# Altium project compbrd.PrjPcb
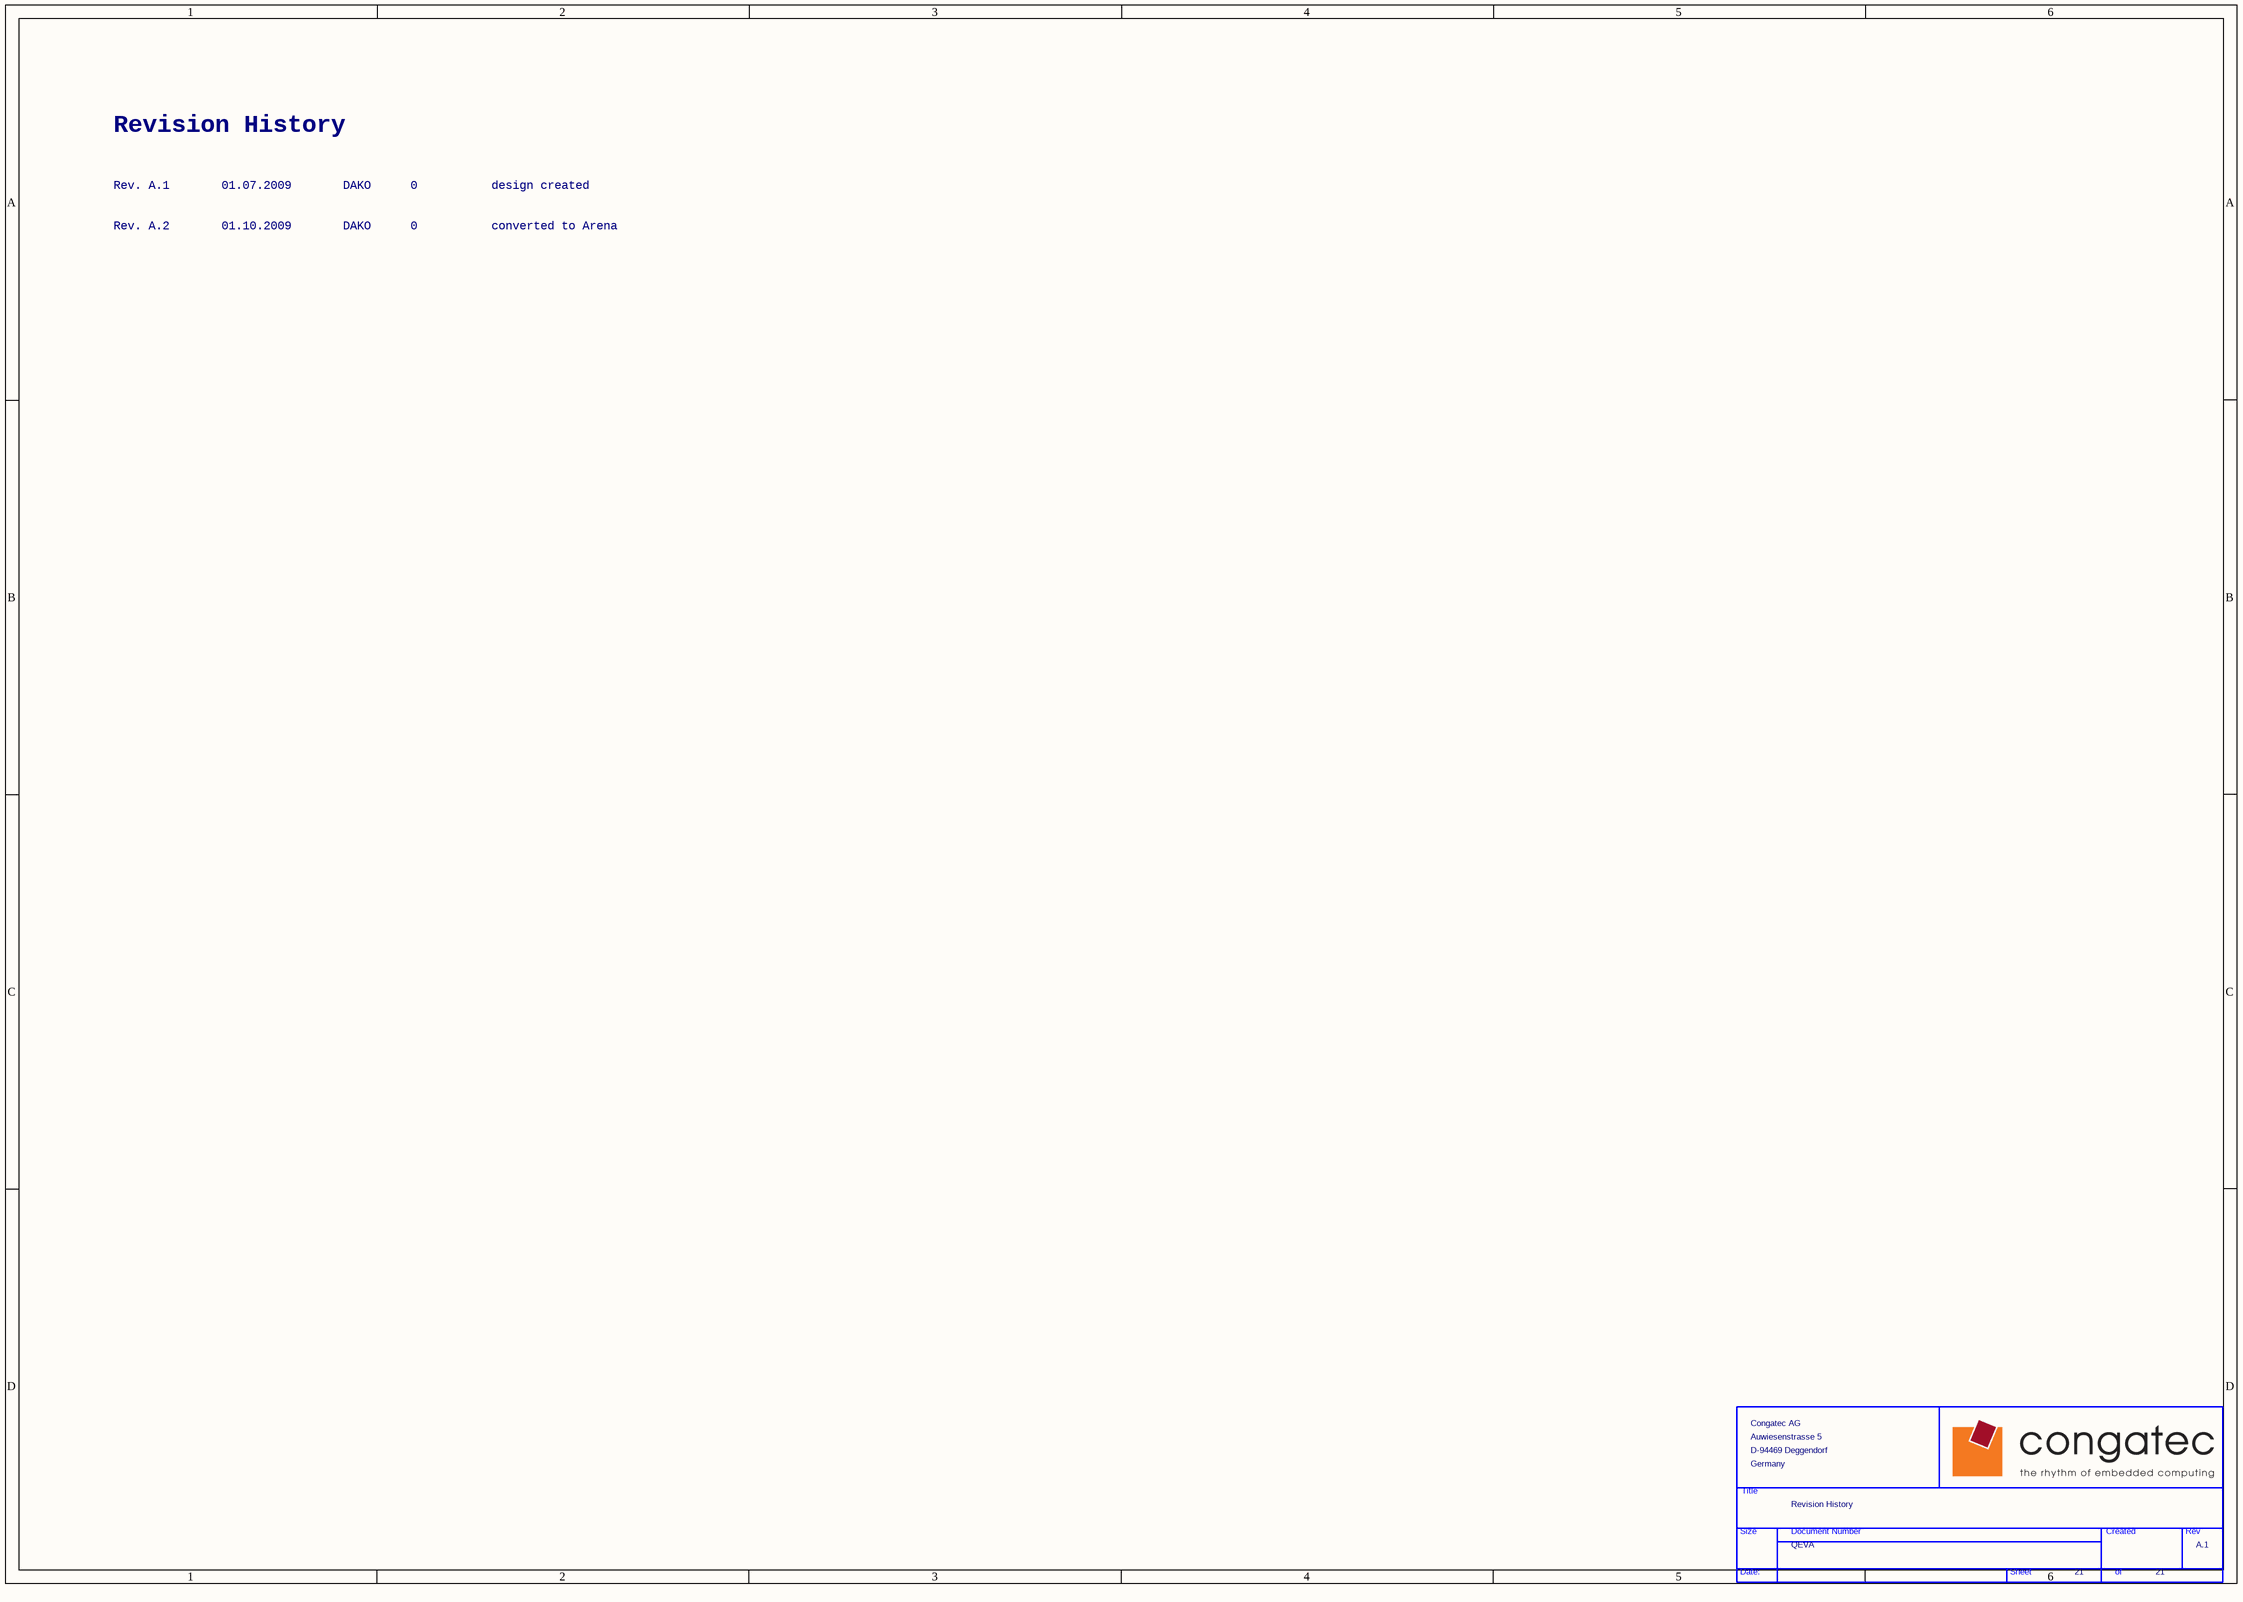
[diagram p0: PG21_ Revision History.SchDoc]
9 sheets, 102 parts. Net scope: global (net labels, ports and power ports of the same name join across sheets).
Sheets:
  PG21_ Revision History.SchDoc
  PG18_ BATT_ SPK _ Featu.SchDoc
  PG17_ LPC FWH _ I2C _ P.SchDoc
  PG14_ Ethernet.SchDoc
  PG13_ USB Ports.SchDoc
  PG12_ SATA _ SDIO.SchDoc
  PG03_ Qseven Connector.SchDoc
  PG02_ Block Diagram.SchDoc
  PG01_ Cover Sheet.SchDoc

## Sheet PG21_ Revision History.SchDoc
size 420 x 297 mm

### Parts
(Parts that share a designator on the sheet are numbered #1, #2 ... from top to bottom, then left to right.)
*#1  Page Count: 21  Title: Revision History  RevCode: A.1  Doc: QEVA  OrgName: Congatec AG  OrgAddr1: Auwiesenstrasse 5  OrgAddr2: D-94469 Deggendorf  OrgAddr3: Germany  (hidden comment: TitleBlock_CONGA)  (graphical)

### Notes on the sheet
- Revision History
- Rev. A.1
- 01.07.2009
- DAKO
- 0
- design created
- Rev. A.2
- 01.10.2009
- converted to Arena
- (in symbol TitleBlock_CONGA) Title; Size; Document Number; Created; Rev; Date:; Sheet; of

### Library data of the parts
*#1 = TitleBlock_CONGA: Page Number: 21; Page Create Date: March  8, 1995

## Sheet PG18_ BATT_ SPK _ Featu.SchDoc
size 420 x 297 mm
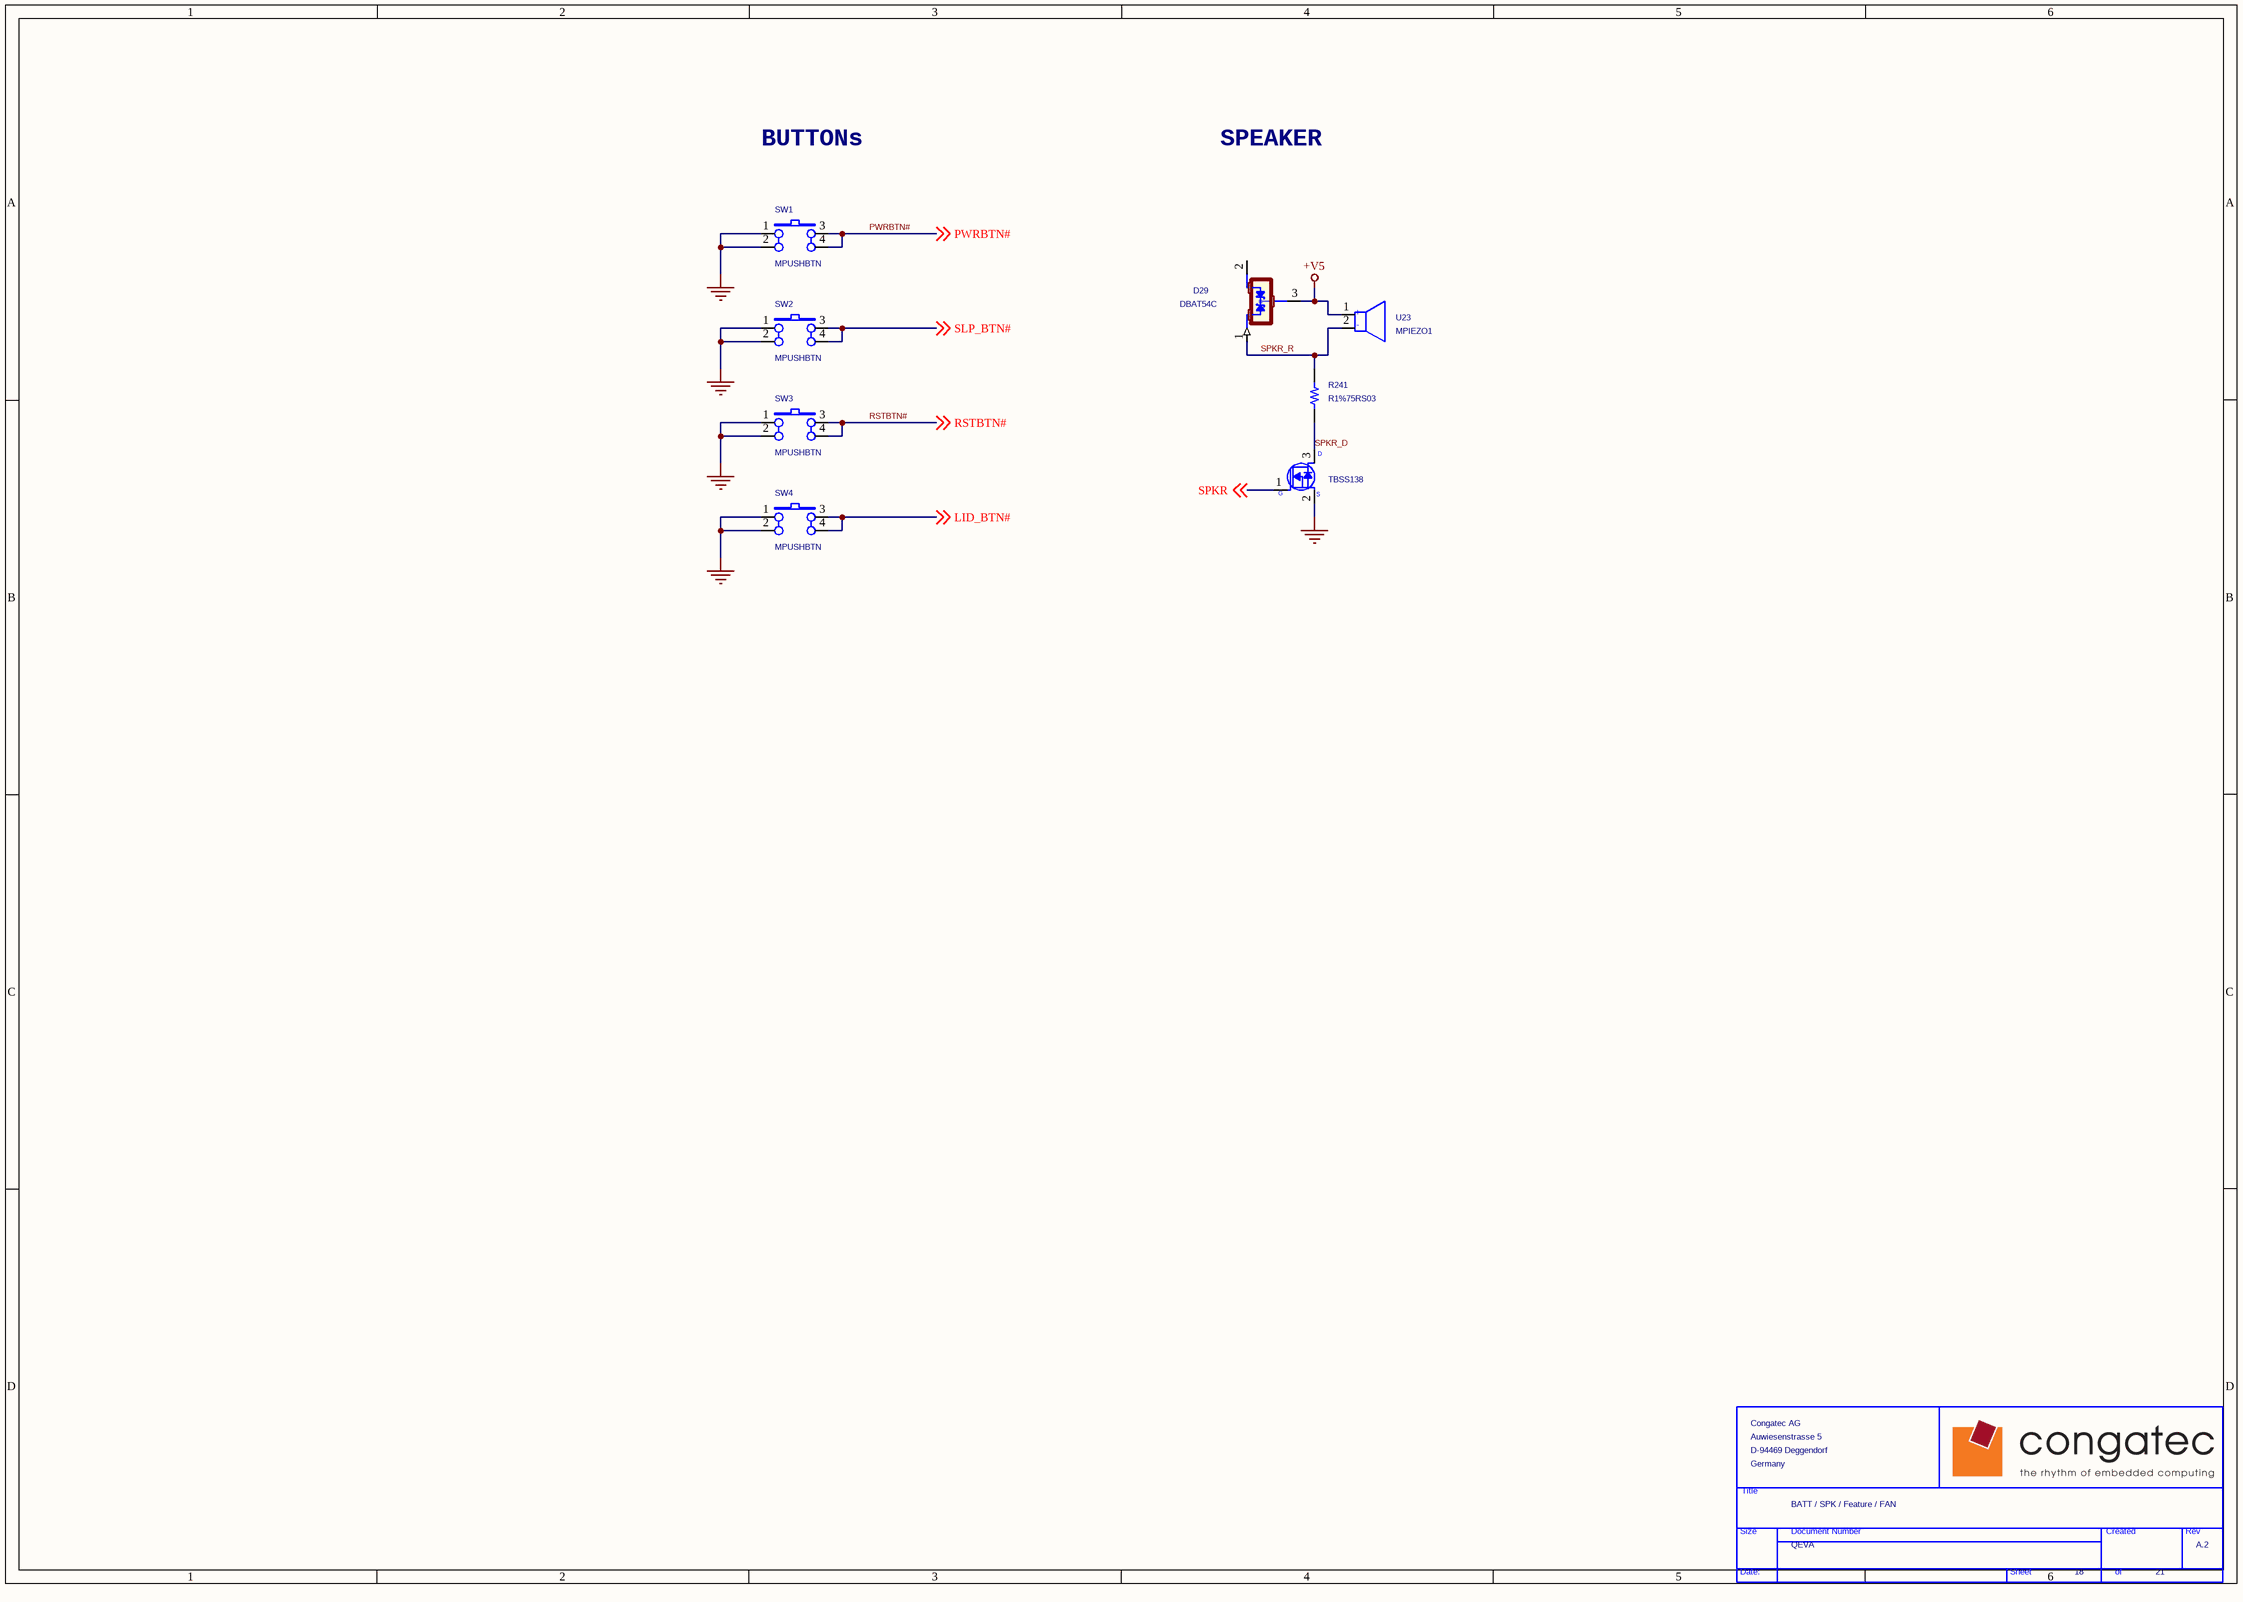
[diagram p1: PG18_ BATT_ SPK _ Featu.SchDoc]

### Parts
(Parts that share a designator on the sheet are numbered #1, #2 ... from top to bottom, then left to right.)
*#2  Page Count: 21  Page Number: 18  Title: BATT / SPK / Feature / FAN  RevCode: A.2  Doc: QEVA  OrgName: Congatec AG  OrgAddr1: Auwiesenstrasse 5  OrgAddr2: D-94469 Deggendorf  OrgAddr3: Germany  (hidden comment: TitleBlock_CONGA)  (graphical)
D29  DBAT54C  [SOT-23A]
Q19  TBSS138  [SOT-23A]
R241  R1%75RS03  [R0603]
SW1  MPUSHBTN  [SW_4P_193x193_H59]
SW2  MPUSHBTN  [SW_4P_193x193_H59]
SW3  MPUSHBTN  [SW_4P_193x193_H59]
SW4  MPUSHBTN  [SW_4P_193x193_H59]
U23  MPIEZO1  [BUZZER2D]

### Nets
+V5: D29.3(ANODE) U23.1
GND: Q19.2(S) SW1.1 SW1.2 SW2.1 SW2.2 SW3.1 SW3.2 SW4.1 SW4.2
LID_BTN#: SW4.3(PTH_1) SW4.4(PTH_2) ; off-sheet LID_BTN#
PWRBTN#: SW1.3(PTH_1) SW1.4(PTH_2) ; off-sheet PWRBTN#
RSTBTN#: SW3.3(PTH_1) SW3.4(PTH_2) ; off-sheet RSTBTN#
SLP_BTN#: SW2.3(PTH_1) SW2.4(PTH_2) ; off-sheet SLP_BTN#
SPKR: Q19.1(G) ; off-sheet SPKR
SPKR_D: Q19.3(D) R241.1
SPKR_R: D29.1(CATHODE_1) R241.2 U23.2

Not connected (* = marked no-connect by the designer): D29 2(CATHODE_2)

### Notes on the sheet
- BUTTONs
- SPEAKER
- (in symbol 175_BUZZER_2P_0) +; -
- (in symbol TitleBlock_CONGA) Title; Size; Document Number; Created; Rev; Date:; Sheet; of

### Library data of the parts
D29 = 130_Schottky_SOT-23A_CC_1: *DIODE Schottky BAT54C SMT SOT-23 3PIN; Part Number: 1300005440; Manufacture Part Number: BAT54 SMD T/R試BAT54C; Part_Number: 42500002; BOM_Level: 1; Package: SOT-23; ProcessType: SMT; Revision: A
Q19 = 131_SOT-23A_GSD_0: MOSFET MPN BSS138_NL SMD SOT-23 3P 50V N-channe; Part_Number: 44000026; Part Number: 1310000011; BOM_Level: 1; ProcessType: SMT; Revision: B; Manufacture Part Number: BSS138_NL; Package: SOT-23
R241 = 10_R_0_Dup1: R 75 1/10W 5% SMD 0603 CR WO/Pb; Part_Number: 45502007; Part Number: 105A707509; Manufacture Part Number: 23227026759L試2322 702 60759L試2322 702 60759L試0603WGJ0750T5E試RC0603JR-0775RL試RM06JTN750; BOM_Level: 1; ProcessType: SMT; Revision: A; Tolerance: 5%; Package: 0603
SW1-SW4 = 160_SW_STS-05-A_0: SMD TACTILE SWITCH 4P 4.9*4.9*1.5mmSTS-05-A; Part_Number: 47500025; Part Number: 1600000031; BOM_Level: 1; ProcessType: SMT; Revision: A; Manufacture Part Number: STS-05-A; Package: SW6PSMD
U23 = 175_BUZZER_2P_0: BUZZER 12*9.5mm,P-P=6.5mm L=3.0mm 40mA 5V 85dB; Part Number: 1759400002; Manufacture Part Number: BPL-SAT-1205HE3-LF試PAC-WT-1205-P; Part_Number: 48200001; ProcessType: DIP; BOM_Level: 1; Package: 12*9.5mm,P-P=6.5mm; Revision: A
*#2 = TitleBlock_CONGA: Page Create Date: March  8, 1995

## Sheet PG17_ LPC FWH _ I2C _ P.SchDoc
size 420 x 297 mm
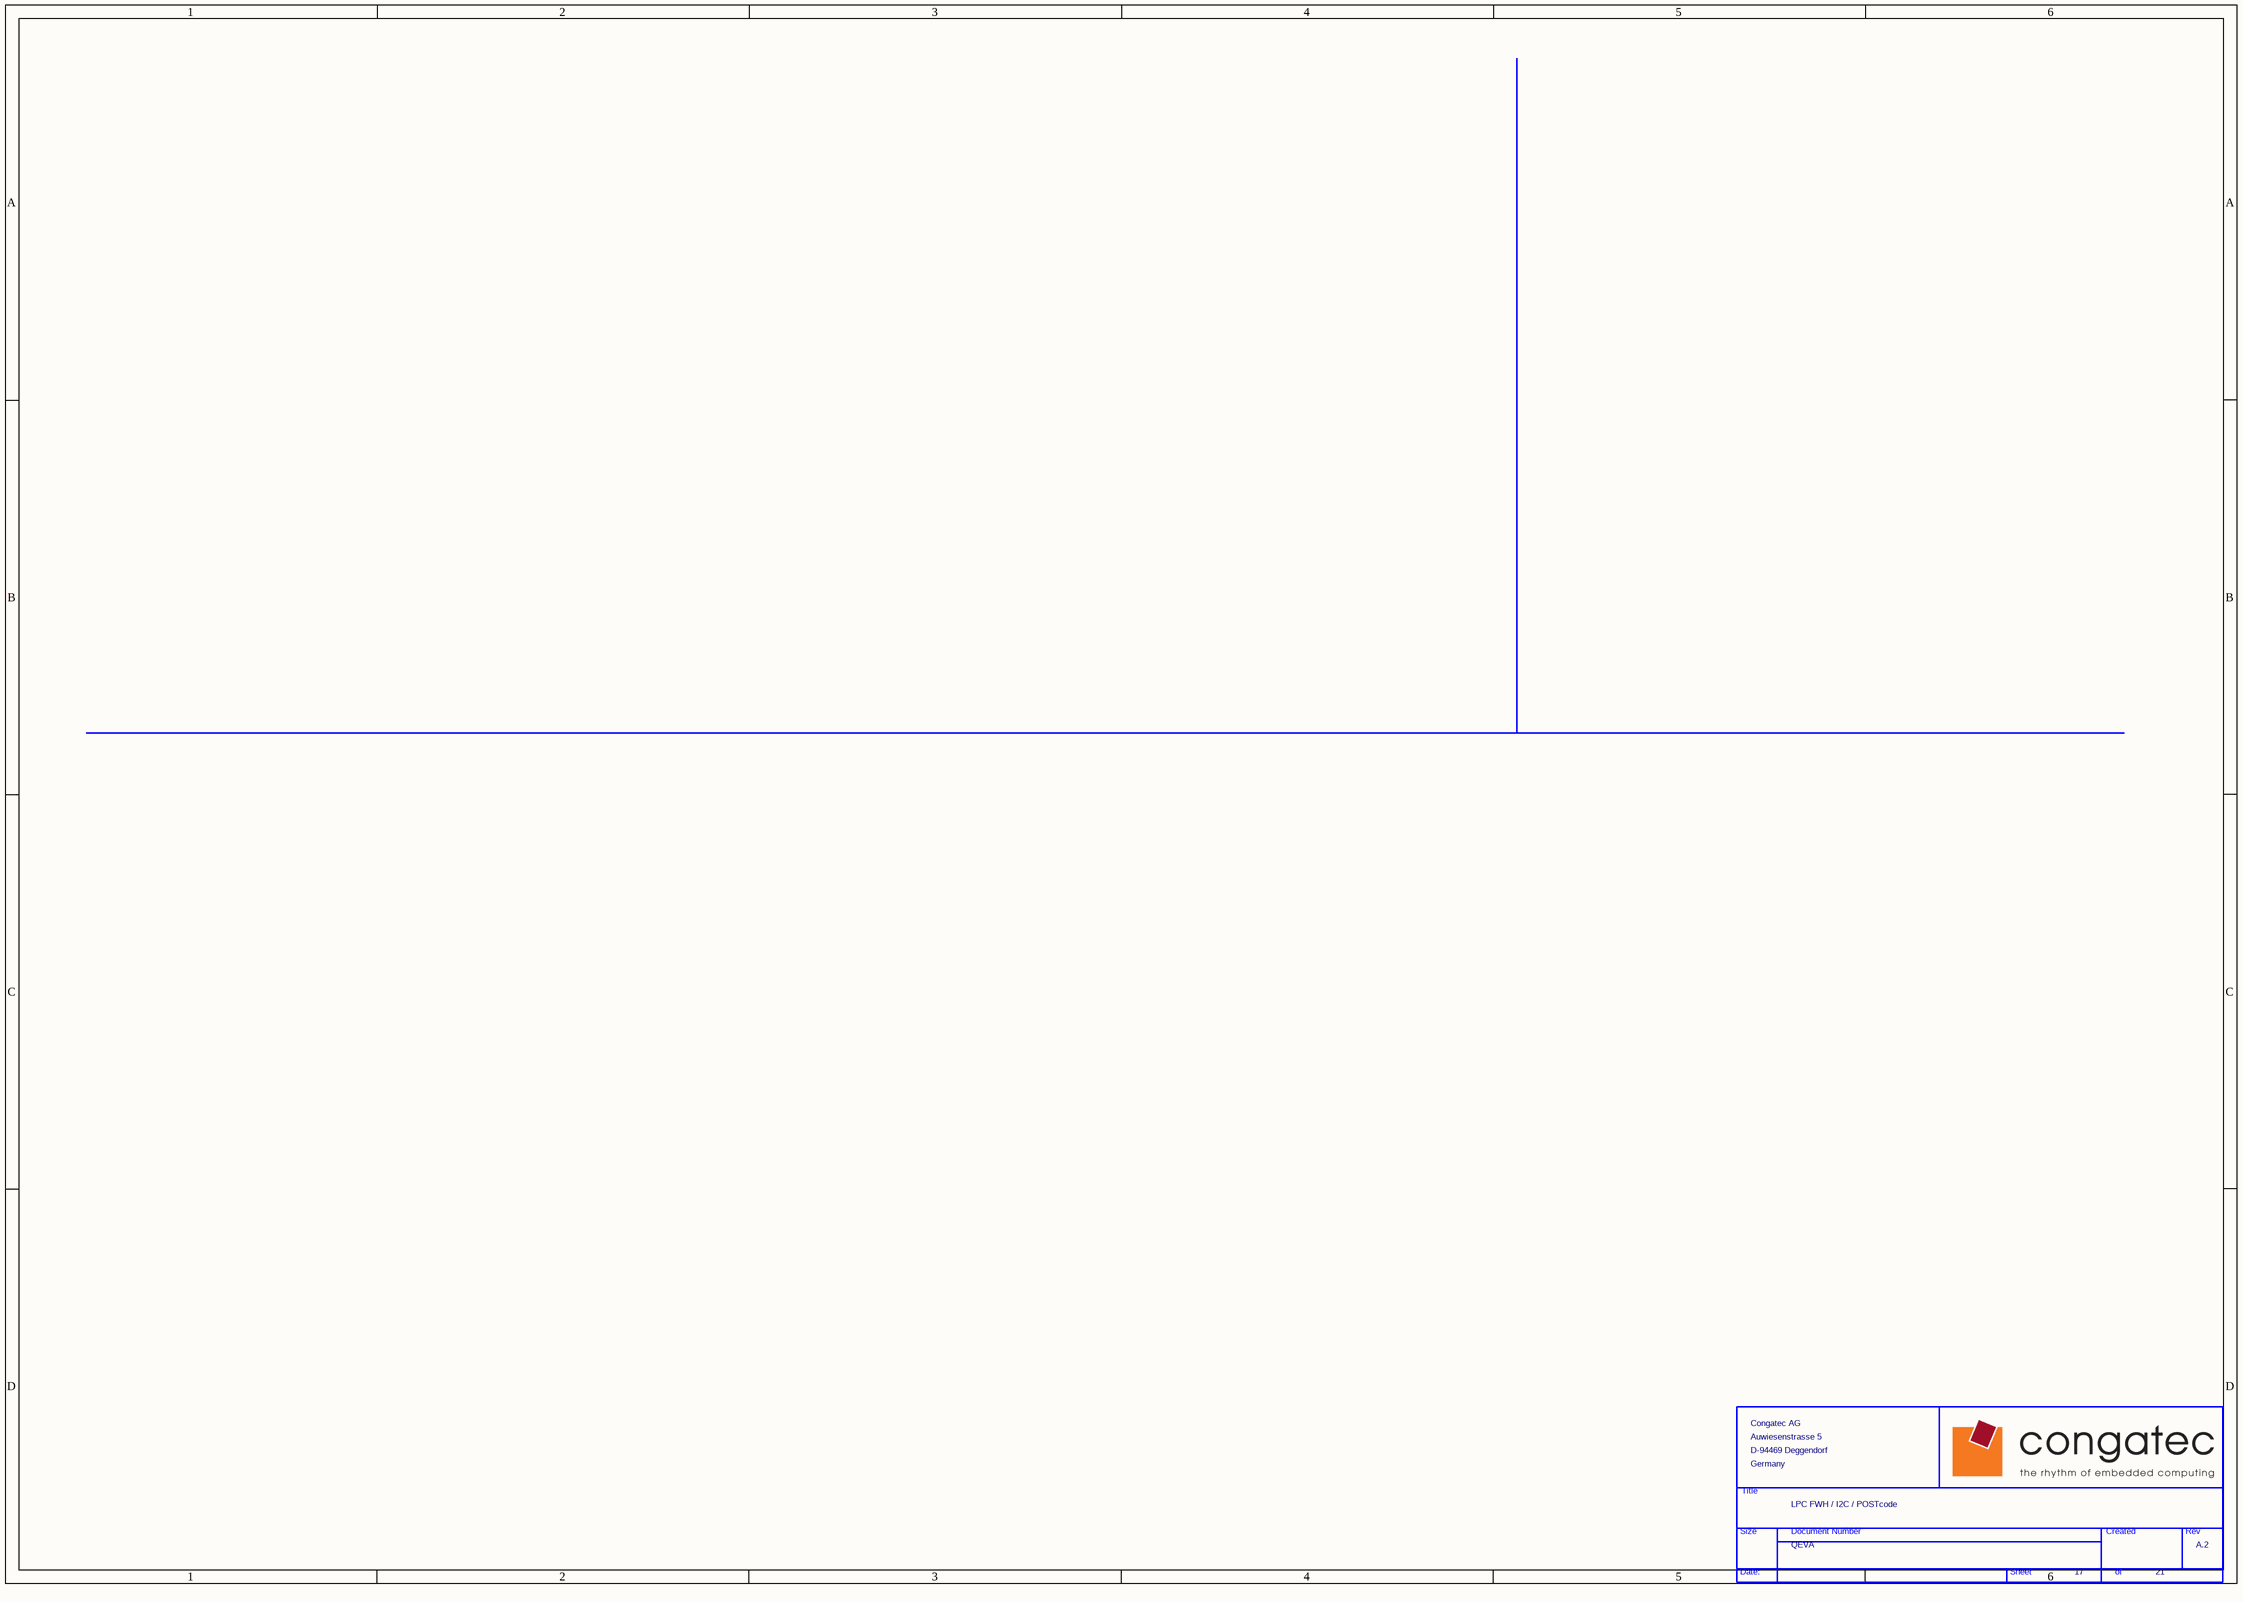
[diagram p2: PG17_ LPC FWH _ I2C _ P.SchDoc]

### Parts
(Parts that share a designator on the sheet are numbered #1, #2 ... from top to bottom, then left to right.)
*#3  Page Count: 21  Page Number: 17  Title: LPC FWH / I2C / POSTcode  RevCode: A.2  Doc: QEVA  OrgName: Congatec AG  OrgAddr1: Auwiesenstrasse 5  OrgAddr2: D-94469 Deggendorf  OrgAddr3: Germany  (hidden comment: TitleBlock_CONGA)  (graphical)

### Notes on the sheet
- (in symbol TitleBlock_CONGA) Title; Size; Document Number; Created; Rev; Date:; Sheet; of

### Library data of the parts
*#3 = TitleBlock_CONGA: Page Create Date: March  8, 1995

## Sheet PG14_ Ethernet.SchDoc
size 420 x 297 mm
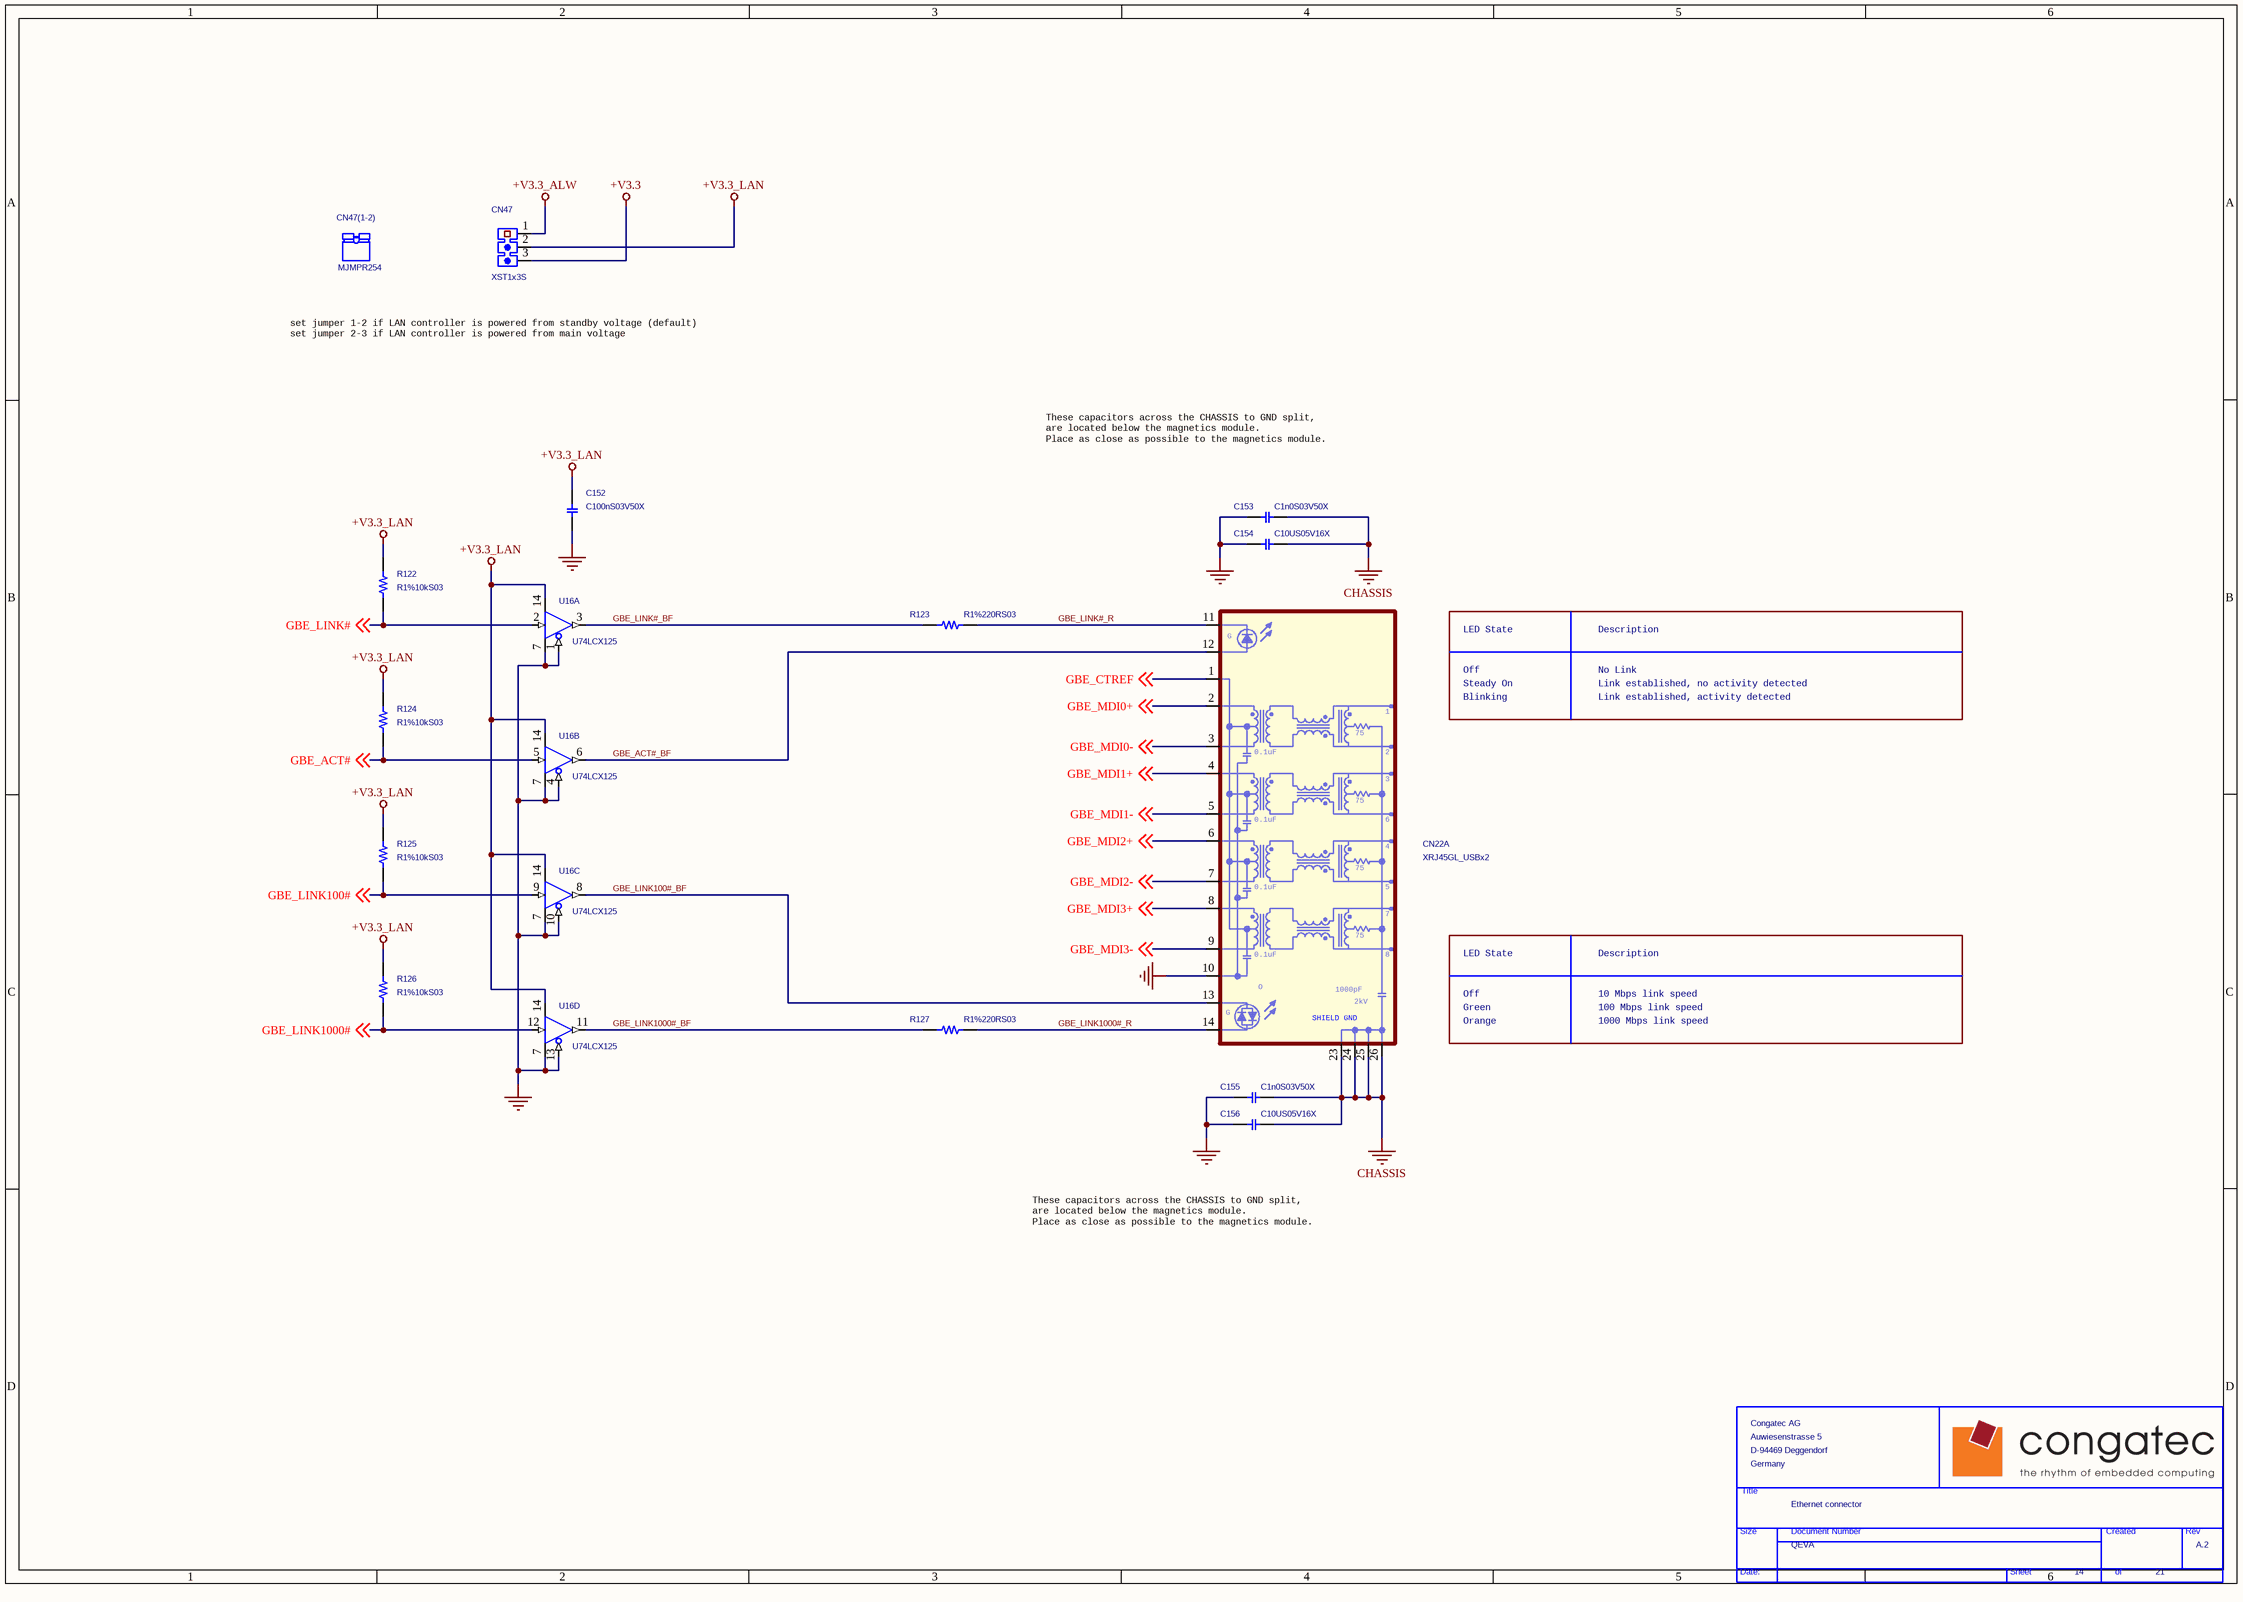
[diagram p3: PG14_ Ethernet.SchDoc]

### Parts
(Parts that share a designator on the sheet are numbered #1, #2 ... from top to bottom, then left to right.)
*#4  Page Count: 21  Page Number: 14  Title: Ethernet connector  RevCode: A.2  Doc: QEVA  OrgName: Congatec AG  OrgAddr1: Auwiesenstrasse 5  OrgAddr2: D-94469 Deggendorf  OrgAddr3: Germany  (hidden comment: TitleBlock_CONGA)  (graphical)
C152  C100nS03V50X  [C0603]
C153  C1n0S03V50X  [C0603]
C154  C10US05V16X  [C0805]
C155  C1n0S03V50X  [C0603]
C156  C10US05V16X  [C0805]
CN22  XRJ45GL_USBx2  [RJ45-P3515619W9]  (part A of 3)
CN47  XST1x3S  [JH3X1V]
CN47(1-2)  MJMPR254
R122  R1%10kS03  [R0603]
R123  R1%220RS03  [R0603]
R124  R1%10kS03  [R0603]
R125  R1%10kS03  [R0603]
R126  R1%10kS03  [R0603]
R127  R1%220RS03  [R0603]
U16  U74LCX125  [SOIC14]  (parts A,B,C,D of 4)

### Nets
+V3.3: CN47.3
+V3.3_ALW: CN47.1
+V3.3_LAN: C152.1 CN47.2 R122.1 R124.1 R125.1 R126.1 U16.14(VCC)
CHASSIS: C153.2 C154.2 C155.2 C156.2 CN22.23(GND_1) CN22.24(GND_2) CN22.25(GND_3) CN22.26(GND_4)
GND: C152.2 C153.1 C154.1 C155.1 C156.1 CN22.10(TCT2) U16.1(1OE) U16.4(2OE) U16.7(GND) U16.10(3OE) U16.13(4OE)
GBE_ACT#: R124.2 U16.5(2A) ; off-sheet GBE_ACT#
GBE_ACT#_BF: CN22.12(ACT+) U16.6(2Y)
GBE_CTREF: CN22.1(TCT1) ; off-sheet GBE_CTREF
GBE_LINK100#: R125.2 U16.9(3A) ; off-sheet GBE_LINK100#
GBE_LINK100#_BF: CN22.13(LINK1) U16.8(3Y)
GBE_LINK1000#: R126.2 U16.12(4A) ; off-sheet GBE_LINK1000#
GBE_LINK1000#_BF: R127.1 U16.11(4Y)
GBE_LINK1000#_R: CN22.14(LINK2) R127.2
GBE_LINK#: R122.2 U16.2(1A) ; off-sheet GBE_LINK#
GBE_LINK#_BF: R123.1 U16.3(1Y)
GBE_LINK#_R: CN22.11(ACT-) R123.2
GBE_MDI0+: CN22.2(0+) ; off-sheet GBE_MDI0+
GBE_MDI0-: CN22.3(0-) ; off-sheet GBE_MDI0-
GBE_MDI1+: CN22.4(1+) ; off-sheet GBE_MDI1+
GBE_MDI1-: CN22.5(1-) ; off-sheet GBE_MDI1-
GBE_MDI2+: CN22.6(2+) ; off-sheet GBE_MDI2+
GBE_MDI2-: CN22.7(2-) ; off-sheet GBE_MDI2-
GBE_MDI3+: CN22.8(3+) ; off-sheet GBE_MDI3+
GBE_MDI3-: CN22.9(3-) ; off-sheet GBE_MDI3-

### Notes on the sheet
- set jumper 1-2 if LAN controller is powered from standby voltage (default)
  set jumper 2-3 if LAN controller is powered from main voltage
- These capacitors across the CHASSIS to GND split,
  are located below the magnetics module.
  Place as close as possible to the magnetics module.
- LED State
- Description
- Off
- Steady On
- Blinking
- No Link
- Link established, no activity detected
- Link established, activity detected
- 10 Mbps link speed
- Green
- Orange
- 100 Mbps link speed
- 1000 Mbps link speed
- (in symbol 1652_RJ45-P3515619W9_0, part A) G; 75; 0.1uF; O; 1000pF; 2kV; SHIELD GND
- (in symbol TitleBlock_CONGA) Title; Size; Document Number; Created; Rev; Date:; Sheet; of

### Library data of the parts
C152 = 11_C_0: CAP 0.1U 50V +-10% SMD 0603 X7R WO/Pb; Manufacture Part Number: C1608X7R1H104KT試223858615649; Part Number: 1100000214; Part_Number: 41000289; ProcessType: SMT; Tolerance: 10%; BOM_Level: 1; Package: 0603; Revision: A
C153 C155 = 11_C_0: CAP 1000pF 50V 10% 0603 MLCC; Part Number: 1124510290; Manufacture Part Number: 2238 586 15623試C1608X7R1H102K試2238 586 15623; Part_Number: 41000292; ProcessType: SMT; BOM_Level: 1; Tolerance: 10%; Package: 0603; Revision: A
C154 C156 = 11_C_0: CAP 10u 6.3V +/-10% SMD 0805 MLCC X5R KEMET; Manufacture Part Number: C0805C106K9PAC; Part Number: 1100000316; Part_Number: 41000185; ProcessType: SMT; Tolerance: 10%; BOM_Level: 1; Package: 0805; Revision: A
CN22 = 1652_RJ45-P3515619W9_0: PhoneJack RJ45+USB*2 90D(F) W/LED&XFMR DIP; Part NUmber: 165250820M; Part_Number: 41500328; Manufacture Part Number: P25@156-P9W9; BOM_Level: 1; Revision: A; ProcessType: DIP; Package: RJ45+USBx2+XFMR
CN47 = 1653_JH3X1V_0: PIN HEADER 3*1P 180D(M) 2.54mm DIP WO/Pb; Part Number: 1653003100; Manufacture Part Number: 205-1x3GS RoHS試1130-000-03S試21N12564-03S10B-01G-6/3; Part_Number: 41500141; BOM_Level: 1; Package: PH3x1P-2.54; ProcessType: DIP; Revision: A
CN47(1-2) = 1653_MINIJUMPER22.54MM_0: MINI JUMPER 2P 180D(F) 2.54mm DIP (yellow); Manufacture Part Number: 1132-040-02試HL0305302試MJ1P-BG0L試151-240-00000306; Part Number: 1653300100; Part_Number: 49000001; BOM_Level: 1; ProcessType: DIP; Package: MINIJUMPER2P-2.54; Revision: A
R122 R124-R126 = 10_R_0_Dup1: R 10K 1/10W 1% SMD 0603 CR WO/Pb; Part_Number: 45502052; Part Number: 105A510023; Manufacture Part Number: RCT02***FTP試0603WAF1002T5E試2322 704 61003L試RC0603FR-0710KL試RM06FTN1002試WR06X8200JT; BOM_Level: 1; ProcessType: SMT; Revision: A; Tolerance: 1%; Package: 0603
R123 = 10_R_0_Dup1: 220 1/10W 5% 0603 CR WO/Pb; Part_Number: 45502013; Manufacture Part Number: 0603WAJ0221T5E試232270260221L試RM06JTN221; Part Number: 105A722009; BOM_Level: 1; ProcessType: SMT; Revision: A; Package: 0603; Tolerance: 5%
R127 = 10_R_0_Dup1: 220 1/10W 5% 0603 CR WO/Pb; Manufacture Part Number: 0603WAJ0221T5E試232270260221L試RM06JTN221; Part Number: 105A722009; Part_Number: 45502013; ProcessType: SMT; BOM_Level: 1; Package: 0603; Tolerance: 5%; Revision: A
U16 = 14S_TI_SN74LVC125ADT_SOIC14_1: IC SMD SN74LVC125ADT SOIC 14P TI; Part_Number: 43000421; Part Number: 14S5A12500; BOM_Level: 1; ProcessType: SMT; Revision: A; Manufacture Part Number: SN74LVC125ADT; Package: SOIC14
*#4 = TitleBlock_CONGA: Page Create Date: March  8, 1995

## Sheet PG13_ USB Ports.SchDoc
size 420 x 297 mm
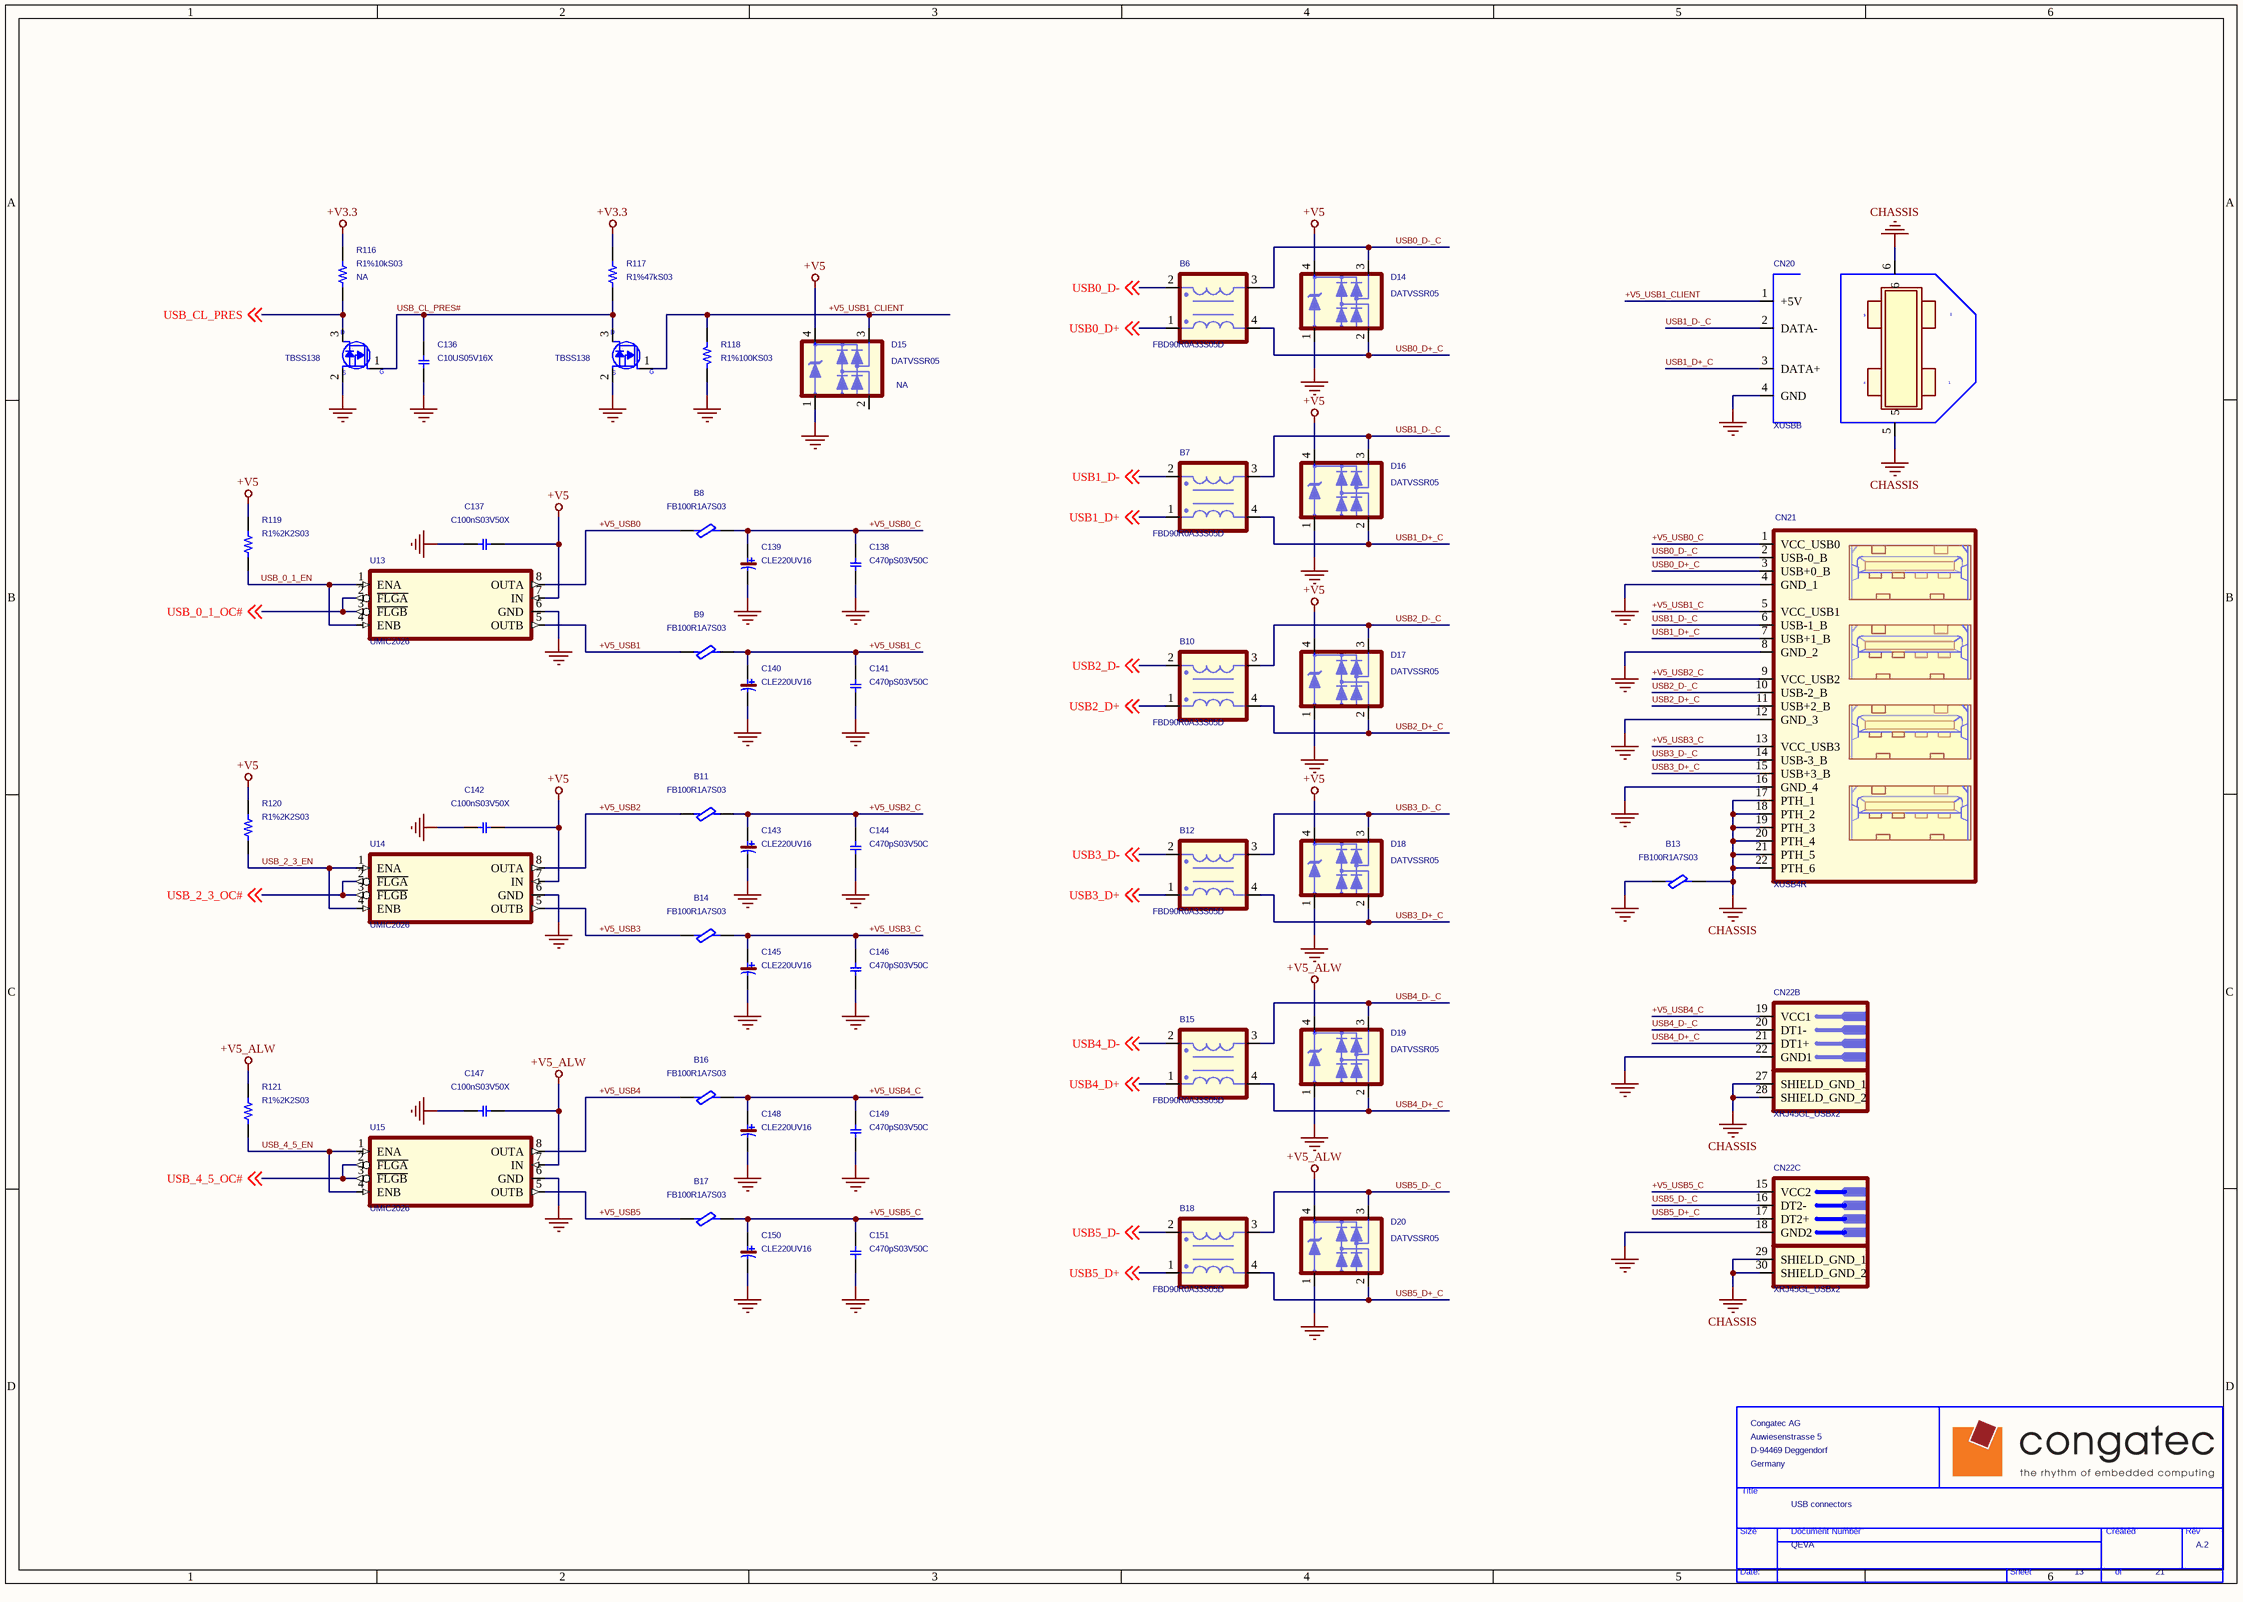
[diagram p4: PG13_ USB Ports.SchDoc]

### Parts
(Parts that share a designator on the sheet are numbered #1, #2 ... from top to bottom, then left to right.)
*#5  Page Count: 21  Page Number: 13  Title: USB connectors  RevCode: A.2  Doc: QEVA  OrgName: Congatec AG  OrgAddr1: Auwiesenstrasse 5  OrgAddr2: D-94469 Deggendorf  OrgAddr3: Germany  (hidden comment: TitleBlock_CONGA)  (graphical)
B6  FBD90R0A33S05D  [ACM2012]
B7  FBD90R0A33S05D  [ACM2012]
B8  FB100R1A7S03  [L0603]
B9  FB100R1A7S03  [L0603]
B10  FBD90R0A33S05D  [ACM2012]
B11  FB100R1A7S03  [L0603]
B12  FBD90R0A33S05D  [ACM2012]
B13  FB100R1A7S03  [L0603]
B14  FB100R1A7S03  [L0603]
B15  FBD90R0A33S05D  [ACM2012]
B16  FB100R1A7S03  [L0603]
B17  FB100R1A7S03  [L0603]
B18  FBD90R0A33S05D  [ACM2012]
C136  C10US05V16X  [C0805]
C137  C100nS03V50X  [C0603]
C138  C470pS03V50C  [C0603]
C139  CLE220UV16  [OEC-D]
C140  CLE220UV16  [OEC-D]
C141  C470pS03V50C  [C0603]
C142  C100nS03V50X  [C0603]
C143  CLE220UV16  [OEC-D]
C144  C470pS03V50C  [C0603]
C145  CLE220UV16  [OEC-D]
C146  C470pS03V50C  [C0603]
C147  C100nS03V50X  [C0603]
C148  CLE220UV16  [OEC-D]
C149  C470pS03V50C  [C0603]
C150  CLE220UV16  [OEC-D]
C151  C470pS03V50C  [C0603]
CN20  XUSBB  [USB-BT-V]
CN21  XUSB4R  [USBX4-V]
CN22  XRJ45GL_USBx2  [RJ45-P3515619W9]  (parts B,C of 3)
D14  DATVSSR05  [SOT-143-SR05]
D15  DATVSSR05  Mounted: NA  [SOT-143-SR05]
D16  DATVSSR05  [SOT-143-SR05]
D17  DATVSSR05  [SOT-143-SR05]
D18  DATVSSR05  [SOT-143-SR05]
D19  DATVSSR05  [SOT-143-SR05]
D20  DATVSSR05  [SOT-143-SR05]
Q11  TBSS138  [SOT-23A]
Q12  TBSS138  [SOT-23A]
R116  R1%10kS03  Mounted: NA  [R0603]
R117  R1%47kS03  [R0603]
R118  R1%100KS03  [R0603]
R119  R1%2K2S03  [R0603]
R120  R1%2K2S03  [R0603]
R121  R1%2K2S03  [R0603]
U13  UMIC2026  [SOIC8]
U14  UMIC2026  [SOIC8]
U15  UMIC2026  [SOIC8]

### Nets
+V3.3: R116.1 R117.1
+V5: C137.2 C142.2 D14.4(CATHODE) D15.4(CATHODE) D16.4(CATHODE) D17.4(CATHODE) D18.4(CATHODE) R119.2 R120.2 U13.7(IN) U14.7(IN)
+V5_ALW: C147.2 D19.4(CATHODE) D20.4(CATHODE) R121.2 U15.7(IN)
CHASSIS: B13.2 CN20.5 CN20.6 CN21.17(PTH_1) CN21.18(PTH_2) CN21.19(PTH_3) CN21.20(PTH_4) CN21.21(PTH_5) CN21.22(PTH_6) CN22.27(SHIELD_GND_1) CN22.28(SHIELD_GND_2) CN22.29(SHIELD_GND_1) CN22.30(SHIELD_GND_2)
GND: B13.1 C136.2 C137.1 C138.2 C139.2 C140.2 C141.2 C142.1 C143.2 C144.2 C145.2 C146.2 C147.1 C148.2 C149.2 C150.2 C151.2 CN20.4(GND) CN21.4(GND_1) CN21.8(GND_2) CN21.12(GND_3) CN21.16(GND_4) CN22.18(GND2) CN22.22(GND1) D14.1(ANODE) D15.1(ANODE) D16.1(ANODE) D17.1(ANODE) D18.1(ANODE) D19.1(ANODE) D20.1(ANODE) Q11.2(S) Q12.2(S) R118.1 U13.6(GND) U14.6(GND) U15.6(GND)
+V5_USB0: B8.1 U13.8(OUTA)
+V5_USB0_C: B8.2 C138.1 C139.1 CN21.1(VCC_USB0)
+V5_USB1: B9.1 U13.5(OUTB)
+V5_USB1_C: B9.2 C140.1 C141.1 CN21.5(VCC_USB1)
+V5_USB1_CLIENT: CN20.1(+5V) D15.3 Q12.1(G) R118.2
+V5_USB2: B11.1 U14.8(OUTA)
+V5_USB2_C: B11.2 C143.1 C144.1 CN21.9(VCC_USB2)
+V5_USB3: B14.1 U14.5(OUTB)
+V5_USB3_C: B14.2 C145.1 C146.1 CN21.13(VCC_USB3)
+V5_USB4: B16.1 U15.8(OUTA)
+V5_USB4_C: B16.2 C148.1 C149.1 CN22.19(VCC1)
+V5_USB5: B17.1 U15.5(OUTB)
+V5_USB5_C: B17.2 C150.1 C151.1 CN22.15(VCC2)
USB0_D+: B6.1(L1) ; off-sheet USB0_D+
USB0_D+_C: B6.4(L4) CN21.3(USB+0_B) D14.2
USB0_D-: B6.2(L2) ; off-sheet USB0_D-
USB0_D-_C: B6.3(L3) CN21.2(USB-0_B) D14.3
USB1_D+: B7.1(L1) ; off-sheet USB1_D+
USB1_D+_C: B7.4(L4) CN20.3(DATA+) CN21.7(USB+1_B) D16.2
USB1_D-: B7.2(L2) ; off-sheet USB1_D-
USB1_D-_C: B7.3(L3) CN20.2(DATA-) CN21.6(USB-1_B) D16.3
USB2_D+: B10.1(L1) ; off-sheet USB2_D+
USB2_D+_C: B10.4(L4) CN21.11(USB+2_B) D17.2
USB2_D-: B10.2(L2) ; off-sheet USB2_D-
USB2_D-_C: B10.3(L3) CN21.10(USB-2_B) D17.3
USB3_D+: B12.1(L1) ; off-sheet USB3_D+
USB3_D+_C: B12.4(L4) CN21.15(USB+3_B) D18.2
USB3_D-: B12.2(L2) ; off-sheet USB3_D-
USB3_D-_C: B12.3(L3) CN21.14(USB-3_B) D18.3
USB4_D+: B15.1(L1) ; off-sheet USB4_D+
USB4_D+_C: B15.4(L4) CN22.21(DT1+) D19.2
USB4_D-: B15.2(L2) ; off-sheet USB4_D-
USB4_D-_C: B15.3(L3) CN22.20(DT1-) D19.3
USB5_D+: B18.1(L1) ; off-sheet USB5_D+
USB5_D+_C: B18.4(L4) CN22.17(DT2+) D20.2
USB5_D-: B18.2(L2) ; off-sheet USB5_D-
USB5_D-_C: B18.3(L3) CN22.16(DT2-) D20.3
USB_0_1_EN: R119.1 U13.1(ENA) U13.4(ENB)
USB_0_1_OC#: U13.2(~{FLGA}) U13.3(~{FLGB}) ; off-sheet USB_0_1_OC#
USB_2_3_EN: R120.1 U14.1(ENA) U14.4(ENB)
USB_2_3_OC#: U14.2(~{FLGA}) U14.3(~{FLGB}) ; off-sheet USB_2_3_OC#
USB_4_5_EN: R121.1 U15.1(ENA) U15.4(ENB)
USB_4_5_OC#: U15.2(~{FLGA}) U15.3(~{FLGB}) ; off-sheet USB_4_5_OC#
USB_CL_PRES: Q11.3(D) R116.2 ; off-sheet USB_CL_PRES
USB_CL_PRES#: C136.1 Q11.1(G) Q12.3(D) R117.2

Not connected (* = marked no-connect by the designer): D15 2

### Notes on the sheet
- (in symbol TitleBlock_CONGA) Title; Size; Document Number; Created; Rev; Date:; Sheet; of

### Library data of the parts
B6 B7 B10 B12 B15 B18 = 1212_FILTER_0: * Inductor Common-MODE FILTER ACM2012-900-2P SMD; Part_Number: 43500027; Part Number: 1212309007; Manufacture Part Number: ACM2012-900-2P-TL; BOM_Level: 1; ProcessType: SMT; Revision: A; Package: 2.0*1.2*1.3mm
B8 B9 B11 B14 B16 B17 = 1212_BEAD_0: Bead 120 +-25% 2A SMD 0603 BLM18PG121SN1 WO/Pb; Part_Number: 43500008; Part Number: 1212000056; BOM_Level: 1; Tolerance: 25%; ProcessType: SMT; Revision: B; Package: 0603; Manufacture Part Number: BLM18PG121SN1
B13 = 1212_BEAD_0: Bead 120 +-25% 2A SMD 0603 BLM18PG121SN1 WO/Pb; Part_Number: 43500008; Part Number: 1212000056; BOM_Level: 1; ProcessType: SMT; Tolerance: 25%; Revision: B; Manufacture Part Number: BLM18PG121SN1; Package: 0603
C136 = 11_C_0: CAP 10u 6.3V +/-10% SMD 0805 MLCC X5R KEMET; Part Number: 1100000316; Manufacture Part Number: C0805C106K9PAC; Part_Number: 41000185; Tolerance: 10%; ProcessType: SMT; BOM_Level: 1; Package: 0805; Revision: A
C137 = 11_C_0: CAP 0.1U 50V +-10% SMD 0603 X7R WO/Pb; Part_Number: 41000289; Manufacture Part Number: C1608X7R1H104KT試223858615649; Part Number: 1100000214; BOM_Level: 1; ProcessType: SMT; Tolerance: 10%; Revision: A; Package: 0603
C138 C141 C144 C146 C149 C151 = 11_C_0: CAP 470pF 50V 10% 0603 SMD  MCC; Part_Number: 41000322; Part Number: 1124547180; Manufacture Part Number: 2238 586 15618試0603試NPO50/100/200/500V試2238 586 15618試223858615618試CC0603KRX7R9BB471試C1608X7R1H471K試0603B152K500LT; BOM_Level: 1; ProcessType: SMT; Revision: A; Tolerance: 10%; Package: 0603
C139 C140 C143 C145 C148 C150 = 11_C_POLAR_0: *CAP 220uF 16V +-20% SMD 6.3?*7.7 EC LOW ESR; Part_Number: 41000366; Part Number: 1111622190; Manufacture Part Number: MVY16V220MF80試16CE220AX; BOM_Level: 1; Tolerance: 20%; ProcessType: SMT; Revision: A; Package: EC-?6.3*7.7MM
C142 C147 = 11_C_0: CAP 0.1U 50V +-10% SMD 0603 X7R WO/Pb; Part Number: 1100000214; Manufacture Part Number: C1608X7R1H104KT試223858615649; Part_Number: 41000289; Tolerance: 10%; ProcessType: SMT; BOM_Level: 1; Package: 0603; Revision: A
CN20 = 1654_USB-BT-V_0: USB CONN. 4P 90D(M) TYPE B SUYIN; Part_Number: 41500326; Manufacture Part Number: 020123MR004S200PA; Part Number: 1654904300; BOM_Level: 1; ProcessType: DIP; Revision: A; Package: USB4P
CN21 = 1654_USBX4-V_ATYPE_0: USB CONN. 16P 90D(M) DIP 4PORT TYPE A; Part Number: 1654000162; Manufacture Part Number: 0-1734383-1; Part_Number: 41500036; BOM_Level: 1; Package: USBx4-16P; ProcessType: DIP; Revision: A
CN22 = 1652_RJ45-P3515619W9_0: as CN22 on sheet PG14_ Ethernet; Revision: A; Package: RJ45+USBx2+XFMR; ProcessType: DIP
D14 D16-D18 = 130_TVS_SOT-143-SR05_0: Diode TVS SR05.TCT SMD SOT-143 4P 15KV SEMTECH; Part_Number: 42500011; Manufacture(English): Semtech International Ag; Manufacture: ???????????(Semtech International Ag); Part Number: 1300000127; BOM_Level: 1; ProcessType: SMT; Revision: A; Manufacture Part Number: SR05.TCT; Package: SOT-143
D15 = 130_TVS_SOT-143-SR05_0: Diode TVS SR05.TCT SMD SOT-143 4P 15KV SEMTECH; Manufacture(English): Semtech International Ag; Manufacture: ???????????(Semtech International Ag); Part Number: 1300000127; Part_Number: 42500011; ProcessType: SMT; Characteristic: 6V; BOM_Level: 1; Manufacture Part Number: SR05.TCT; Package: SOT-143; Revision: A
D19 D20 = 130_TVS_SOT-143-SR05_0: Diode TVS SR05.TCT SMD SOT-143 4P 15KV SEMTECH; Part_Number: 42500011; Part Number: 1300000127; Manufacture: ???????????(Semtech International Ag); Manufacture(English): Semtech International Ag; BOM_Level: 1; ProcessType: SMT; Revision: A; Package: SOT-143; Manufacture Part Number: SR05.TCT
Q11 Q12 = 131_SOT-23A_GSD_0: as Q19 on sheet PG18_ BATT_ SPK _ Featu; Revision: B; Manufacture Part Number: BSS138_NL; Package: SOT-23
R116 = 10_R_0_Dup1: R 10K 1/10W 1% SMD 0603 CR WO/Pb; Manufacture Part Number: RCT02***FTP試0603WAF1002T5E試2322 704 61003L試RC0603FR-0710KL試RM06FTN1002試WR06X8200JT; Part Number: 105A510023; Part_Number: 45502052; ProcessType: SMT; BOM_Level: 1; Package: 0603; Tolerance: 1%; Revision: A
R117 = 10_R_0_Dup1: 47K 1/10W 5% 0603 CR WO/Pb; Manufacture Part Number: 0603WAJ0473T5E試232270260473L試RM06JTN473; Part Number: 105A747029; Part_Number: 45502068; ProcessType: SMT; BOM_Level: 1; Package: 0603; Tolerance: 5%; Revision: A
R118 = 10_R_0_Dup1: R 100K 1/10W 1% SMD 0603 CR; Part_Number: 45501496; Part Number: 105A510033; Manufacture Part Number: 0603WAF1003T5E試232270461004L試RM06FTN1003; BOM_Level: 1; ProcessType: SMT; Revision: A; Tolerance: 1%; Package: 0603
R119-R121 = 10_R_0_Dup1: R 2.2K 1/10W 1% SMD 0603 CR; Part_Number: 45502036; Part Number: 105A522013; Manufacture Part Number: 0603WGF0222T5E試232270462202L試RM06FTN2201; BOM_Level: 1; ProcessType: SMT; Revision: A; Tolerance: 1%; Package: 0603
U13-U15 = 14S_MICREL_MIC2026-1YM_0: IC SMD MIC2026-1YM SOIC8 WO/Pb MICREL; Part_Number: 43000105; Part Number: 14S2202600; BOM_Level: 1; ProcessType: SMT; Revision: A; Manufacture Part Number: MIC2026-1YM; Package: SOIC8
*#5 = TitleBlock_CONGA: Page Create Date: March  8, 1995

## Sheet PG12_ SATA _ SDIO.SchDoc
size 420 x 297 mm
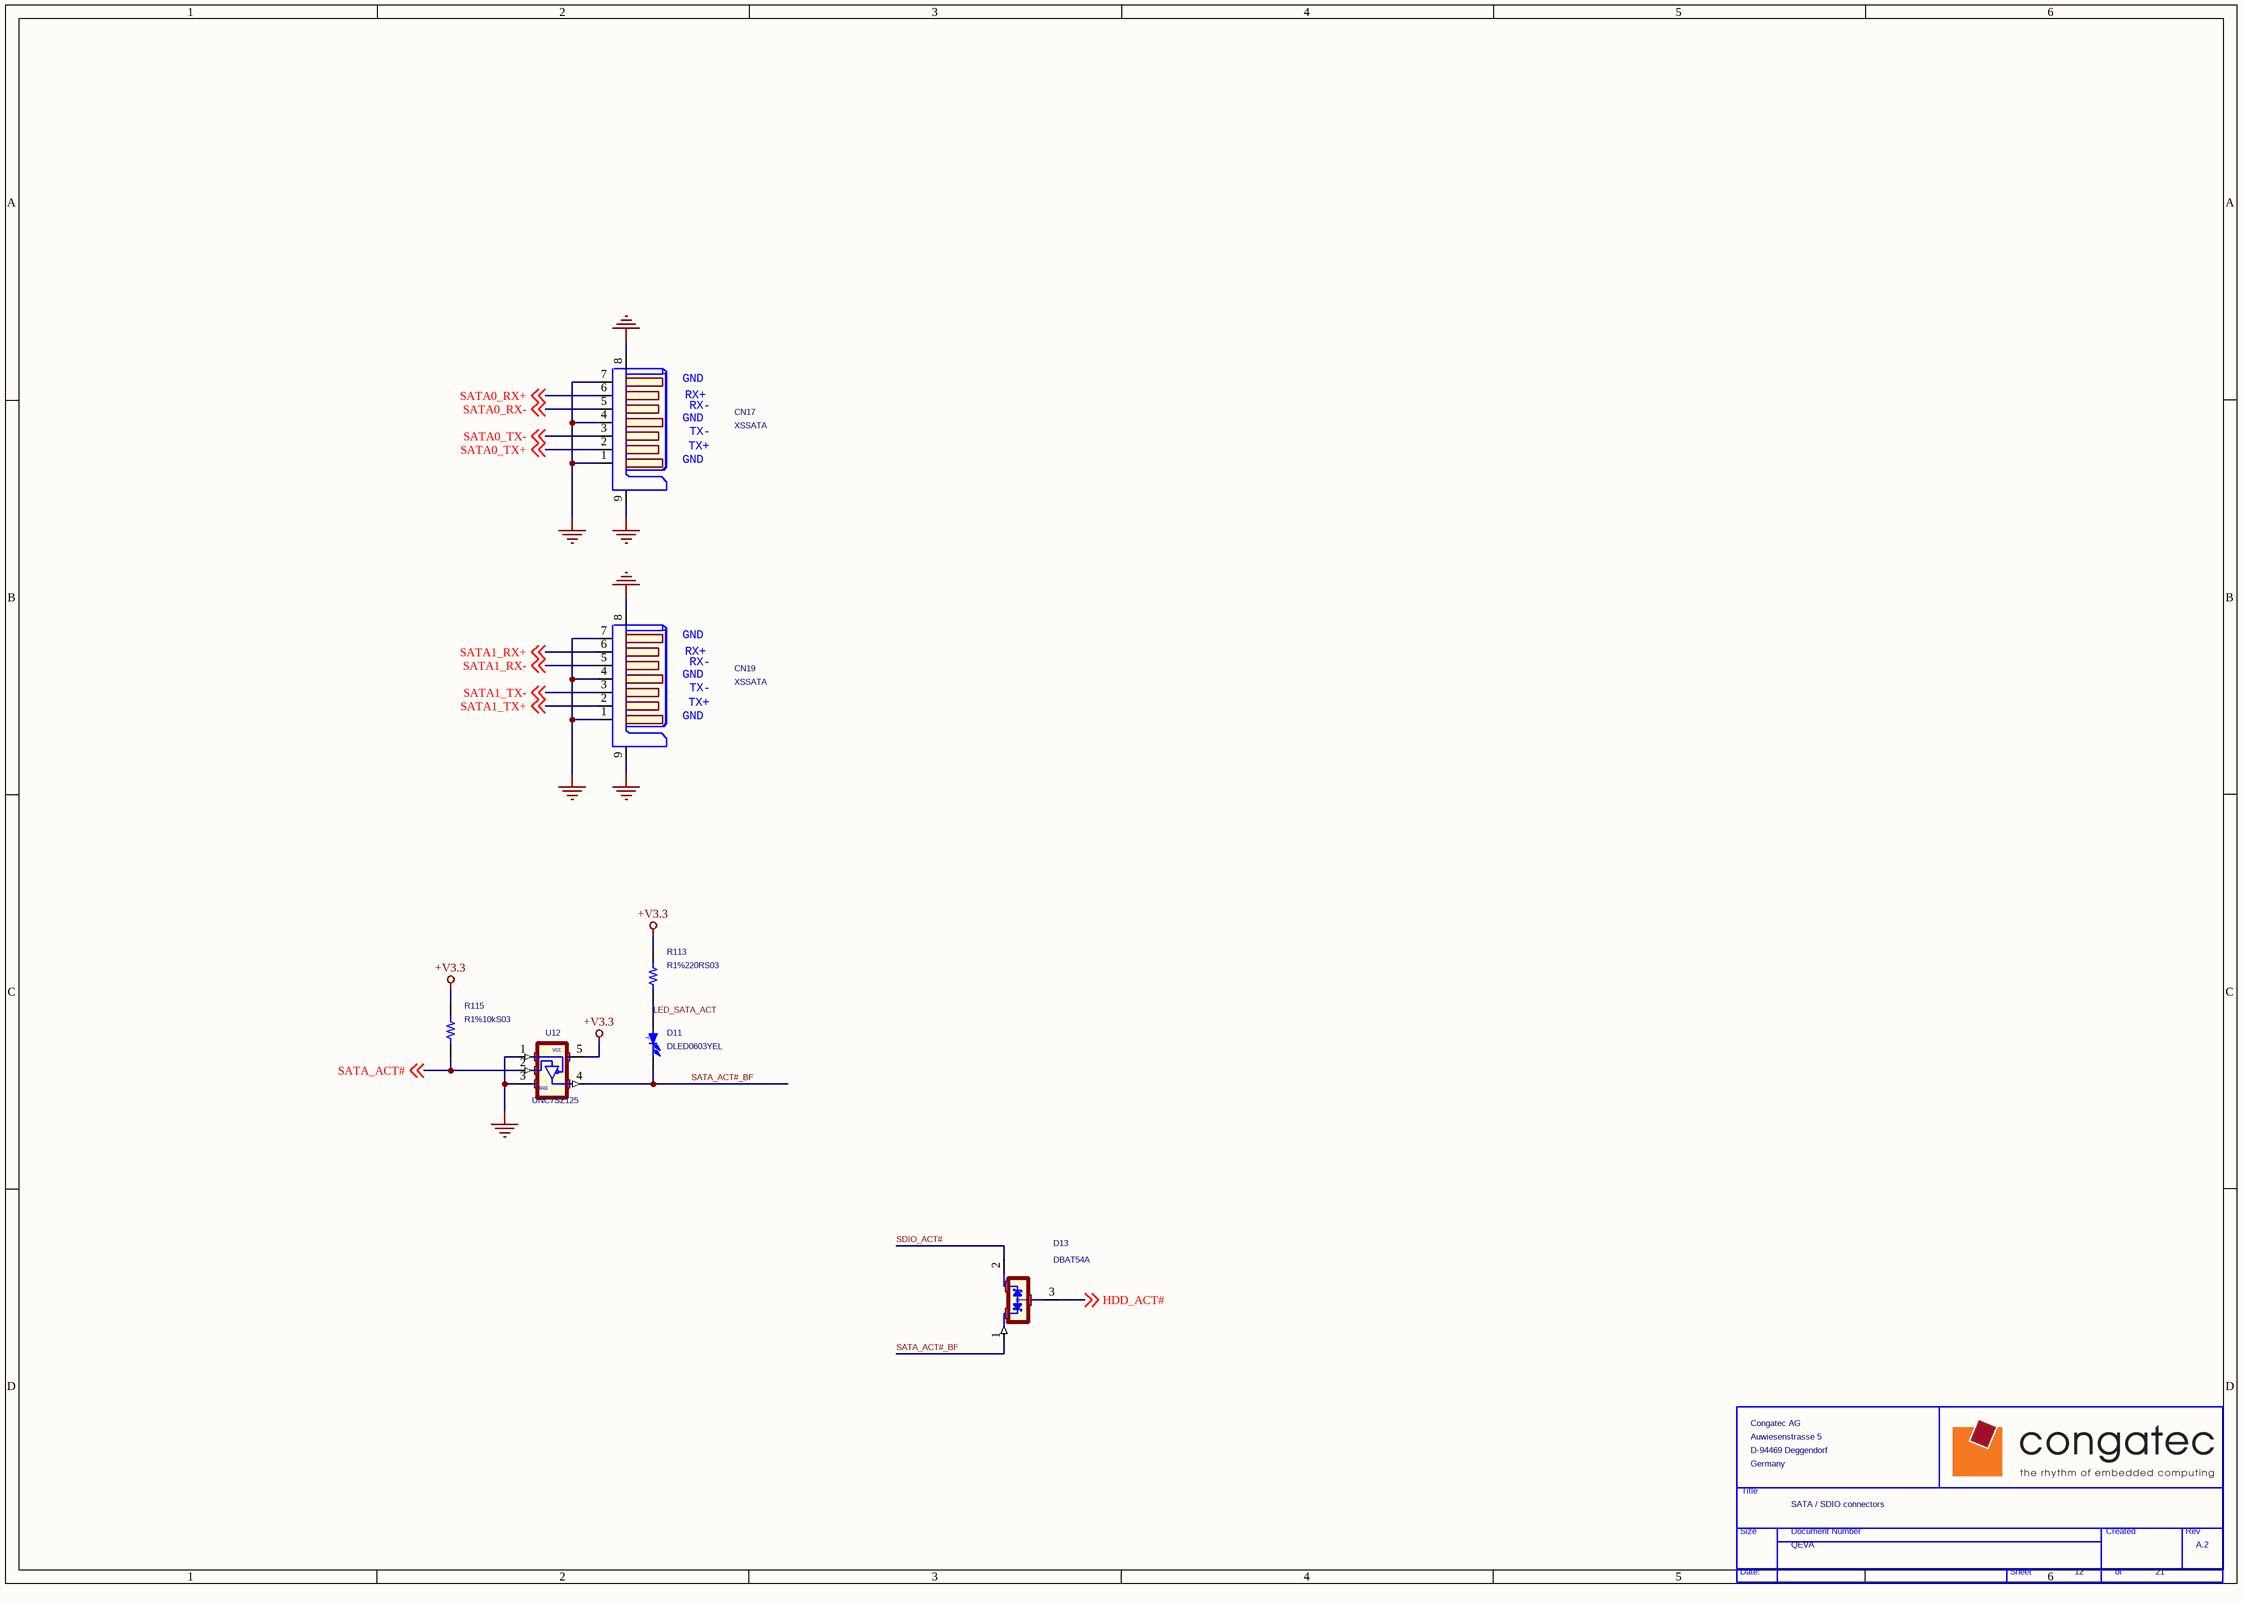
[diagram p5: PG12_ SATA _ SDIO.SchDoc]

### Parts
(Parts that share a designator on the sheet are numbered #1, #2 ... from top to bottom, then left to right.)
*#6  Page Count: 21  Page Number: 12  Title: SATA / SDIO connectors  RevCode: A.2  Doc: QEVA  OrgName: Congatec AG  OrgAddr1: Auwiesenstrasse 5  OrgAddr2: D-94469 Deggendorf  OrgAddr3: Germany  (hidden comment: TitleBlock_CONGA)  (graphical)
CN17  XSSATA  [SATA]
CN19  XSSATA  [SATA]
D11  DLED0603YEL  [LED-0603]
D13  DBAT54A  [SOT-23A]
R113  R1%220RS03  [R0603]
R115  R1%10kS03  [R0603]
U12  UNC7SZ125  [SOT-23-5]

### Nets
+V3.3: R113.1 R115.1 U12.5
GND: CN17.1(GND_1) CN17.4(GND_2) CN17.7(GND_3) CN17.8 CN17.9 CN19.1(GND_1) CN19.4(GND_2) CN19.7(GND_3) CN19.8 CN19.9 U12.1(OE) U12.3
HDD_ACT#: D13.3(ANODE) ; off-sheet HDD_ACT#
LED_SATA_ACT: D11.1(ANODE) R113.2
SATA0_RX+: CN17.6(RX+) ; off-sheet SATA0_RX+
SATA0_RX-: CN17.5(RX-) ; off-sheet SATA0_RX-
SATA0_TX+: CN17.2(TX+) ; off-sheet SATA0_TX+
SATA0_TX-: CN17.3(TX-) ; off-sheet SATA0_TX-
SATA1_RX+: CN19.6(RX+) ; off-sheet SATA1_RX+
SATA1_RX-: CN19.5(RX-) ; off-sheet SATA1_RX-
SATA1_TX+: CN19.2(TX+) ; off-sheet SATA1_TX+
SATA1_TX-: CN19.3(TX-) ; off-sheet SATA1_TX-
SATA_ACT#: R115.2 U12.2(A) ; off-sheet SATA_ACT#
SATA_ACT#_BF: D11.2(CATHODE) D13.1(CATHODE_1) U12.4(B)
SDIO_ACT#: D13.2(CATHODE_2)

### Notes on the sheet
- (in symbol 14S_NC7SZ125M5X_SOT-23-5_0) VCC; GND
- (in symbol 130_LED_LED-0603_Y_0) Y
- (in symbol 1654_SATA_0) GND
- (in symbol TitleBlock_CONGA) Title; Size; Document Number; Created; Rev; Date:; Sheet; of

### Library data of the parts
CN17 CN19 = 1654_SATA_0: Serial ATA 7P 180D(M) DIP 1.27mm WO/Pb; Part_Number: 41500327; Part Number: 1654001158; Manufacture Part Number: WATM-07DBLB2D8UW; BOM_Level: 1; Revision: A; Package: SATA7P; ProcessType: DIP
D11 = 130_LED_LED-0603_Y_0: LED YELLOW SMD 2P 0603 LYQ971 OSRAM; Part_Number: 44500018; Part Number: 1304000017; Manufacture: (DEL)?????????; Manufacture(English): DEL; BOM_Level: 1; ProcessType: SMT; Revision: A; Package: 0603; Manufacture Part Number: LY Q971
D13 = 130_Schottky_SOT-23A_CA_1_Dup1: *DIODE SOT23 BAT54A double Schottky COMMON ANODE; Part_Number: 42500001; Part Number: 1301005440; BOM_Level: 1; ProcessType: SMT; Revision: A; Manufacture Part Number: BAT54A; Package: SOT-23
R113 = 10_R_0_Dup1: 220 1/10W 5% 0603 CR WO/Pb; Part Number: 105A722009; Manufacture Part Number: 0603WAJ0221T5E試232270260221L試RM06JTN221; Part_Number: 45502013; ProcessType: SMT; BOM_Level: 1; Tolerance: 5%; Package: 0603; Revision: A
R115 = 10_R_0_Dup1: R 10K 1/10W 1% SMD 0603 CR WO/Pb; Part Number: 105A510023; Manufacture Part Number: RCT02***FTP試0603WAF1002T5E試2322 704 61003L試RC0603FR-0710KL試RM06FTN1002試WR06X8200JT; Part_Number: 45502052; ProcessType: SMT; BOM_Level: 1; Tolerance: 1%; Package: 0603; Revision: A
U12 = 14S_NC7SZ125M5X_SOT-23-5_0: IC SMD NC7SZ125M5X SOT23-5P; Part_Number: 43000017; Part Number: 14S5A12530; BOM_Level: 1; ProcessType: SMT; Revision: A; Package: SOT-23-5; Manufacture Part Number: NC7SZ125M5X
*#6 = TitleBlock_CONGA: Page Create Date: March  8, 1995

## Sheet PG03_ Qseven Connector.SchDoc
size 420 x 297 mm
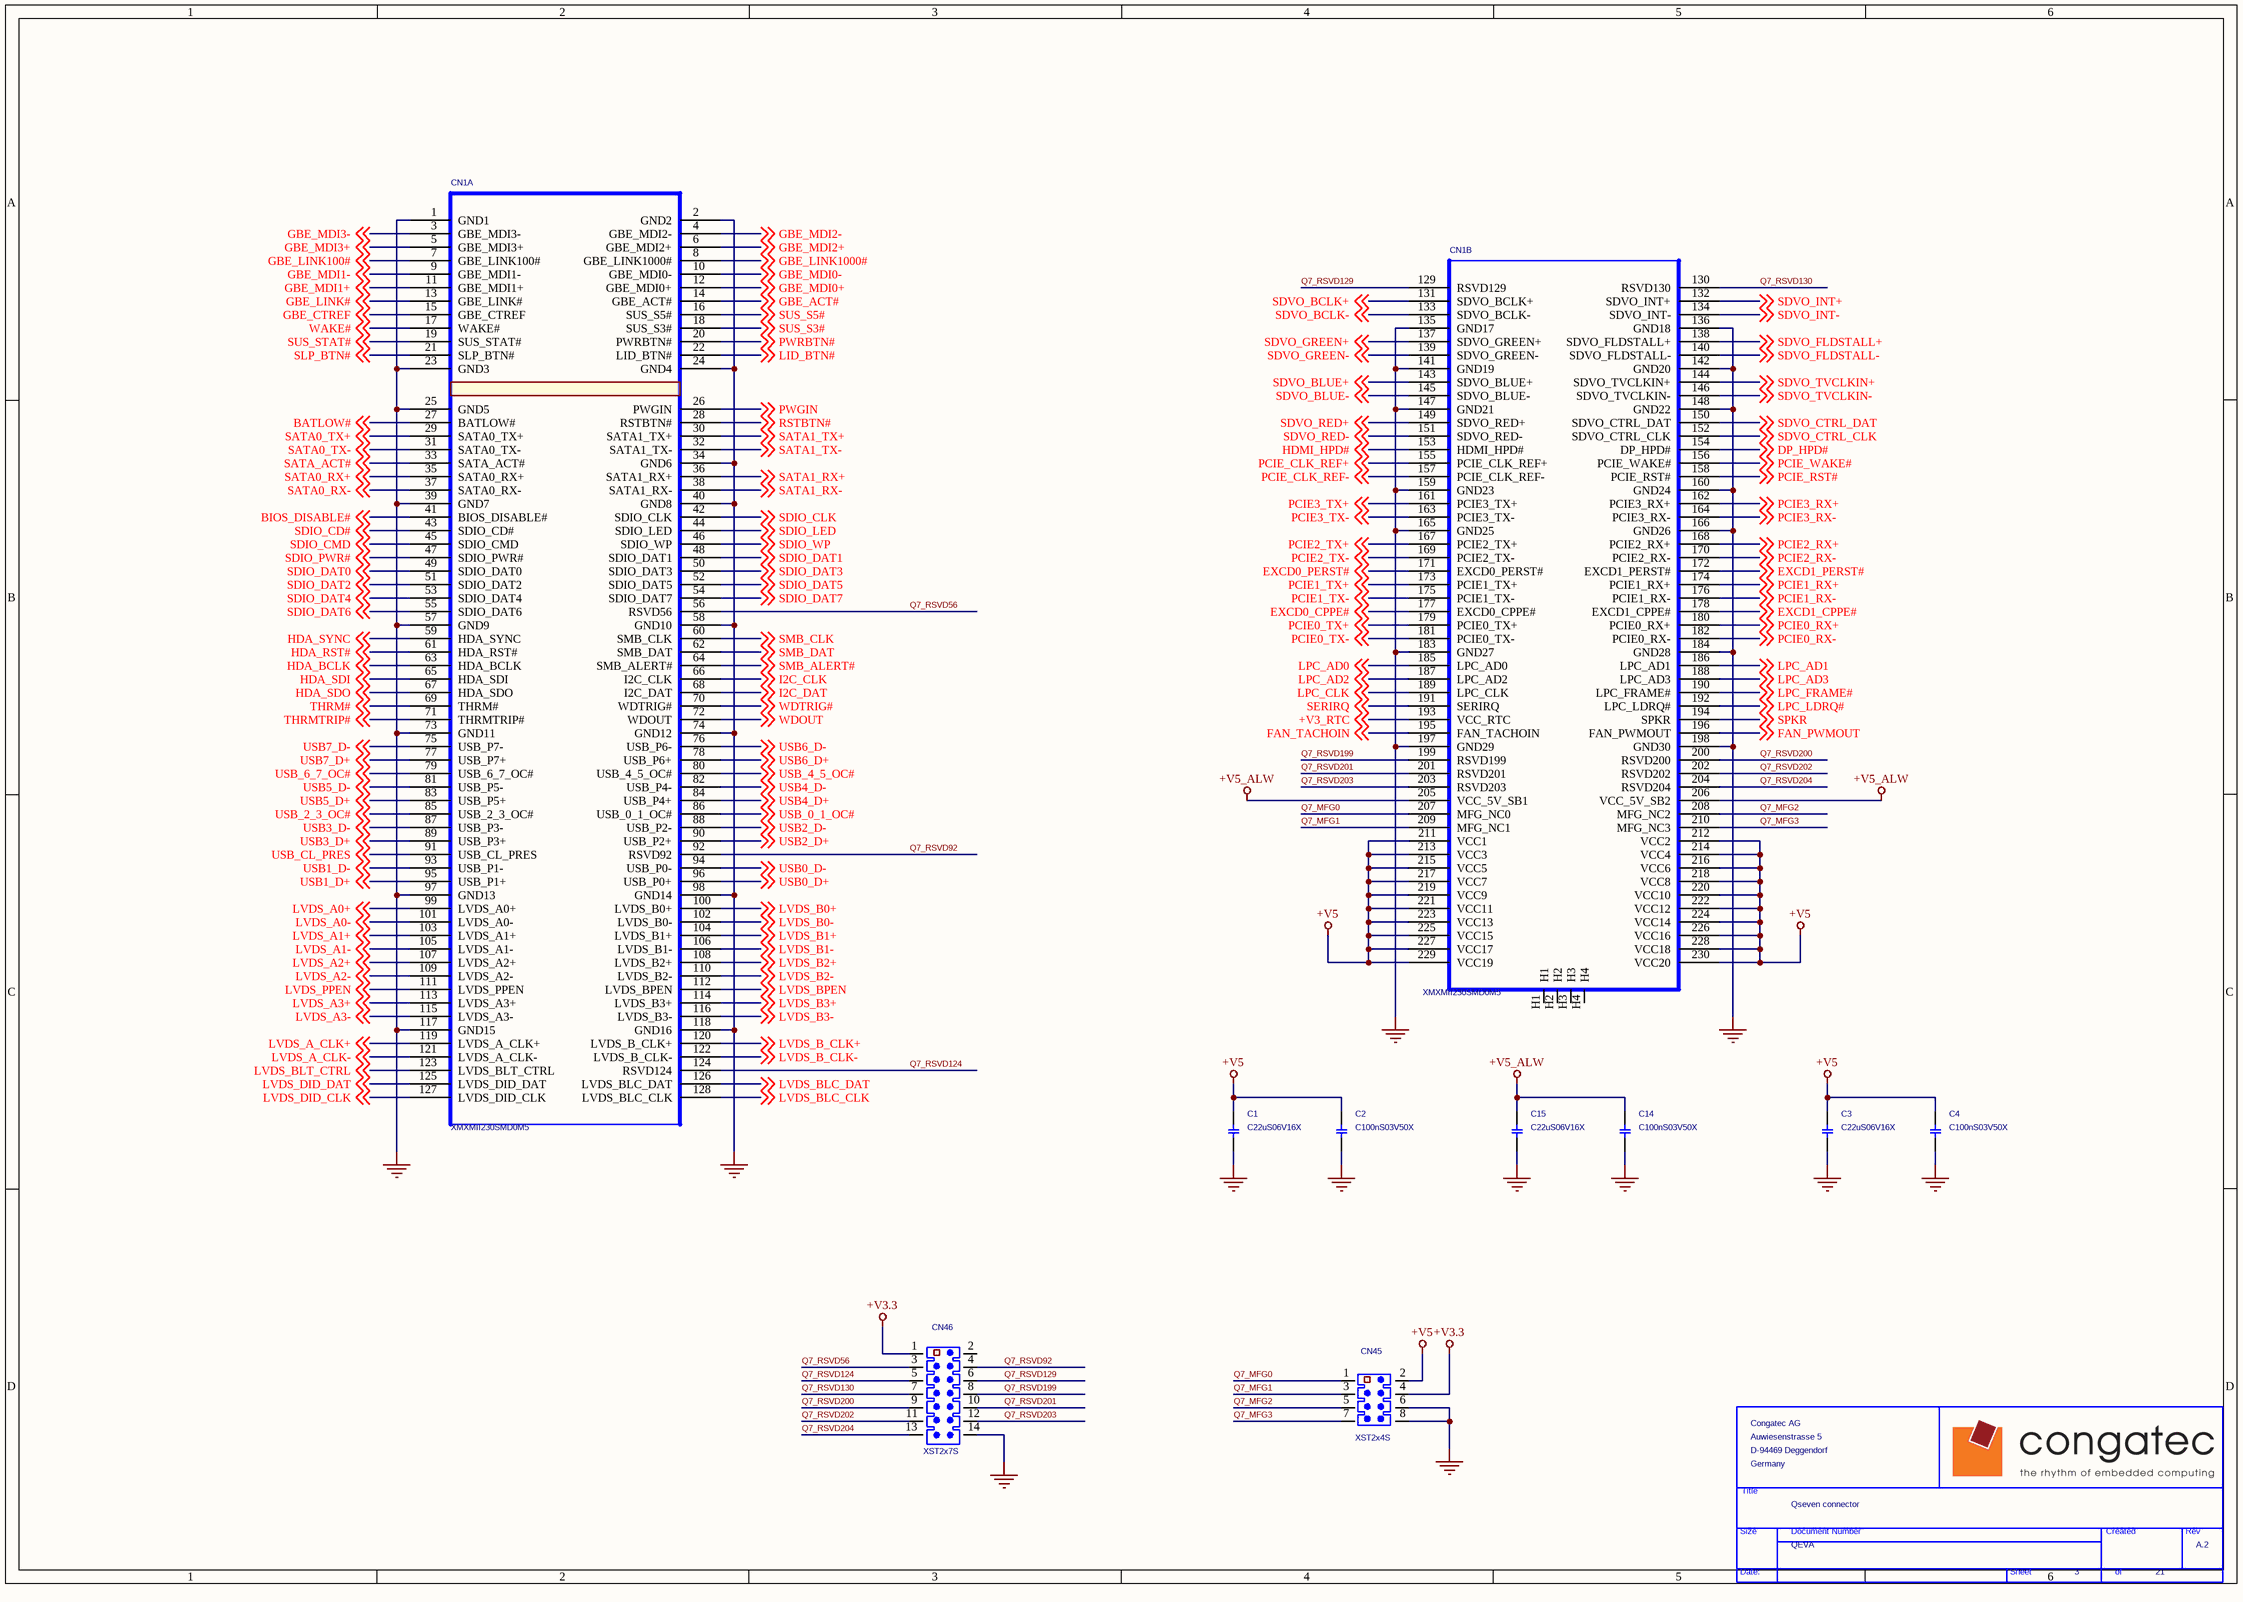
[diagram p6: PG03_ Qseven Connector.SchDoc]

### Parts
(Parts that share a designator on the sheet are numbered #1, #2 ... from top to bottom, then left to right.)
*#7  Page Count: 21  Page Number: 3  Title: Qseven connector  RevCode: A.2  Doc: QEVA  OrgName: Congatec AG  OrgAddr1: Auwiesenstrasse 5  OrgAddr2: D-94469 Deggendorf  OrgAddr3: Germany  (hidden comment: TitleBlock_CONGA)  (graphical)
C1  C22uS06V16X  [C1206-1]
C2  C100nS03V50X  [C0603]
C3  C22uS06V16X  [C1206-1]
C4  C100nS03V50X  [C0603]
C14  C100nS03V50X  [C0603]
C15  C22uS06V16X  [C1206-1]
CN1  XMXMII230SMD0M5  [FOXCONN_AS0B326-S78N-7F]  (parts A,B of 2)
CN45  XST2x4S  [JH4X2V]
CN46  XST2x7S  [JH7X2V]

### Nets
+V3.3: CN45.4 CN46.1
+V5: C1.1 C2.1 C3.1 C4.1 CN1.211(VCC1) CN1.212(VCC2) CN1.213(VCC3) CN1.214(VCC4) CN1.215(VCC5) CN1.216(VCC6) CN1.217(VCC7) CN1.218(VCC8) CN1.219(VCC9) CN1.220(VCC10) CN1.221(VCC11) CN1.222(VCC12) CN1.223(VCC13) CN1.224(VCC14) CN1.225(VCC15) CN1.226(VCC16) CN1.227(VCC17) CN1.228(VCC18) CN1.229(VCC19) CN1.230(VCC20) CN45.2
+V5_ALW: C14.1 C15.1 CN1.205(VCC_5V_SB1) CN1.206(VCC_5V_SB2)
GND: C1.2 C2.2 C3.2 C4.2 C14.2 C15.2 CN1.1(GND1) CN1.2(GND2) CN1.23(GND3) CN1.24(GND4) CN1.25(GND5) CN1.34(GND6) CN1.39(GND7) CN1.40(GND8) CN1.57(GND9) CN1.58(GND10) CN1.73(GND11) CN1.74(GND12) CN1.97(GND13) CN1.98(GND14) CN1.117(GND15) CN1.118(GND16) CN1.135(GND17) CN1.136(GND18) CN1.141(GND19) CN1.142(GND20) CN1.147(GND21) CN1.148(GND22) CN1.159(GND23) CN1.160(GND24) CN1.165(GND25) CN1.166(GND26) CN1.183(GND27) CN1.184(GND28) CN1.197(GND29) CN1.198(GND30) CN45.6 CN45.8 CN46.14
+V3_RTC: CN1.193(VCC_RTC) ; off-sheet +V3_RTC
BATLOW#: CN1.27(BATLOW#) ; off-sheet BATLOW#
BIOS_DISABLE#: CN1.41(BIOS_DISABLE#) ; off-sheet BIOS_DISABLE#
DP_HPD#: CN1.154(DP_HPD#) ; off-sheet DP_HPD#
EXCD0_CPPE#: CN1.177(EXCD0_CPPE#) ; off-sheet EXCD0_CPPE#
EXCD0_PERST#: CN1.171(EXCD0_PERST#) ; off-sheet EXCD0_PERST#
EXCD1_CPPE#: CN1.178(EXCD1_CPPE#) ; off-sheet EXCD1_CPPE#
EXCD1_PERST#: CN1.172(EXCD1_PERST#) ; off-sheet EXCD1_PERST#
FAN_PWMOUT: CN1.196(FAN_PWMOUT) ; off-sheet FAN_PWMOUT
FAN_TACHOIN: CN1.195(FAN_TACHOIN) ; off-sheet FAN_TACHOIN
GBE_ACT#: CN1.14(GBE_ACT#) ; off-sheet GBE_ACT#
GBE_CTREF: CN1.15(GBE_CTREF) ; off-sheet GBE_CTREF
GBE_LINK100#: CN1.7(GBE_LINK100#) ; off-sheet GBE_LINK100#
GBE_LINK1000#: CN1.8(GBE_LINK1000#) ; off-sheet GBE_LINK1000#
GBE_LINK#: CN1.13(GBE_LINK#) ; off-sheet GBE_LINK#
GBE_MDI0+: CN1.12(GBE_MDI0+) ; off-sheet GBE_MDI0+
GBE_MDI0-: CN1.10(GBE_MDI0-) ; off-sheet GBE_MDI0-
GBE_MDI1+: CN1.11(GBE_MDI1+) ; off-sheet GBE_MDI1+
GBE_MDI1-: CN1.9(GBE_MDI1-) ; off-sheet GBE_MDI1-
GBE_MDI2+: CN1.6(GBE_MDI2+) ; off-sheet GBE_MDI2+
GBE_MDI2-: CN1.4(GBE_MDI2-) ; off-sheet GBE_MDI2-
GBE_MDI3+: CN1.5(GBE_MDI3+) ; off-sheet GBE_MDI3+
GBE_MDI3-: CN1.3(GBE_MDI3-) ; off-sheet GBE_MDI3-
HDA_BCLK: CN1.63(HDA_BCLK) ; off-sheet HDA_BCLK
HDA_RST#: CN1.61(HDA_RST#) ; off-sheet HDA_RST#
HDA_SDI: CN1.65(HDA_SDI) ; off-sheet HDA_SDI
HDA_SDO: CN1.67(HDA_SDO) ; off-sheet HDA_SDO
HDA_SYNC: CN1.59(HDA_SYNC) ; off-sheet HDA_SYNC
HDMI_HPD#: CN1.153(HDMI_HPD#) ; off-sheet HDMI_HPD#
I2C_CLK: CN1.66(I2C_CLK) ; off-sheet I2C_CLK
I2C_DAT: CN1.68(I2C_DAT) ; off-sheet I2C_DAT
LID_BTN#: CN1.22(LID_BTN#) ; off-sheet LID_BTN#
LPC_AD0: CN1.185(LPC_AD0) ; off-sheet LPC_AD0
LPC_AD1: CN1.186(LPC_AD1) ; off-sheet LPC_AD1
LPC_AD2: CN1.187(LPC_AD2) ; off-sheet LPC_AD2
LPC_AD3: CN1.188(LPC_AD3) ; off-sheet LPC_AD3
LPC_CLK: CN1.189(LPC_CLK) ; off-sheet LPC_CLK
LPC_FRAME#: CN1.190(LPC_FRAME#) ; off-sheet LPC_FRAME#
LPC_LDRQ#: CN1.192(LPC_LDRQ#) ; off-sheet LPC_LDRQ#
LVDS_A0+: CN1.99(LVDS_A0+) ; off-sheet LVDS_A0+
LVDS_A0-: CN1.101(LVDS_A0-) ; off-sheet LVDS_A0-
LVDS_A1+: CN1.103(LVDS_A1+) ; off-sheet LVDS_A1+
LVDS_A1-: CN1.105(LVDS_A1-) ; off-sheet LVDS_A1-
LVDS_A2+: CN1.107(LVDS_A2+) ; off-sheet LVDS_A2+
LVDS_A2-: CN1.109(LVDS_A2-) ; off-sheet LVDS_A2-
LVDS_A3+: CN1.113(LVDS_A3+) ; off-sheet LVDS_A3+
LVDS_A3-: CN1.115(LVDS_A3-) ; off-sheet LVDS_A3-
LVDS_A_CLK+: CN1.119(LVDS_A_CLK+) ; off-sheet LVDS_A_CLK+
LVDS_A_CLK-: CN1.121(LVDS_A_CLK-) ; off-sheet LVDS_A_CLK-
LVDS_B0+: CN1.100(LVDS_B0+) ; off-sheet LVDS_B0+
LVDS_B0-: CN1.102(LVDS_B0-) ; off-sheet LVDS_B0-
LVDS_B1+: CN1.104(LVDS_B1+) ; off-sheet LVDS_B1+
LVDS_B1-: CN1.106(LVDS_B1-) ; off-sheet LVDS_B1-
LVDS_B2+: CN1.108(LVDS_B2+) ; off-sheet LVDS_B2+
LVDS_B2-: CN1.110(LVDS_B2-) ; off-sheet LVDS_B2-
LVDS_B3+: CN1.114(LVDS_B3+) ; off-sheet LVDS_B3+
LVDS_B3-: CN1.116(LVDS_B3-) ; off-sheet LVDS_B3-
LVDS_B_CLK+: CN1.120(LVDS_B_CLK+) ; off-sheet LVDS_B_CLK+
LVDS_B_CLK-: CN1.122(LVDS_B_CLK-) ; off-sheet LVDS_B_CLK-
LVDS_BLC_CLK: CN1.128(LVDS_BLC_CLK) ; off-sheet LVDS_BLC_CLK
LVDS_BLC_DAT: CN1.126(LVDS_BLC_DAT) ; off-sheet LVDS_BLC_DAT
LVDS_BLT_CTRL: CN1.123(LVDS_BLT_CTRL) ; off-sheet LVDS_BLT_CTRL
LVDS_BPEN: CN1.112(LVDS_BPEN) ; off-sheet LVDS_BPEN
LVDS_DID_CLK: CN1.127(LVDS_DID_CLK) ; off-sheet LVDS_DID_CLK
LVDS_DID_DAT: CN1.125(LVDS_DID_DAT) ; off-sheet LVDS_DID_DAT
LVDS_PPEN: CN1.111(LVDS_PPEN) ; off-sheet LVDS_PPEN
PCIE0_RX+: CN1.180(PCIE0_RX+) ; off-sheet PCIE0_RX+
PCIE0_RX-: CN1.182(PCIE0_RX-) ; off-sheet PCIE0_RX-
PCIE0_TX+: CN1.179(PCIE0_TX+) ; off-sheet PCIE0_TX+
PCIE0_TX-: CN1.181(PCIE0_TX-) ; off-sheet PCIE0_TX-
PCIE1_RX+: CN1.174(PCIE1_RX+) ; off-sheet PCIE1_RX+
PCIE1_RX-: CN1.176(PCIE1_RX-) ; off-sheet PCIE1_RX-
PCIE1_TX+: CN1.173(PCIE1_TX+) ; off-sheet PCIE1_TX+
PCIE1_TX-: CN1.175(PCIE1_TX-) ; off-sheet PCIE1_TX-
PCIE2_RX+: CN1.168(PCIE2_RX+) ; off-sheet PCIE2_RX+
PCIE2_RX-: CN1.170(PCIE2_RX-) ; off-sheet PCIE2_RX-
PCIE2_TX+: CN1.167(PCIE2_TX+) ; off-sheet PCIE2_TX+
PCIE2_TX-: CN1.169(PCIE2_TX-) ; off-sheet PCIE2_TX-
PCIE3_RX+: CN1.162(PCIE3_RX+) ; off-sheet PCIE3_RX+
PCIE3_RX-: CN1.164(PCIE3_RX-) ; off-sheet PCIE3_RX-
PCIE3_TX+: CN1.161(PCIE3_TX+) ; off-sheet PCIE3_TX+
PCIE3_TX-: CN1.163(PCIE3_TX-) ; off-sheet PCIE3_TX-
PCIE_CLK_REF+: CN1.155(PCIE_CLK_REF+) ; off-sheet PCIE_CLK_REF+
PCIE_CLK_REF-: CN1.157(PCIE_CLK_REF-) ; off-sheet PCIE_CLK_REF-
PCIE_RST#: CN1.158(PCIE_RST#) ; off-sheet PCIE_RST#
PCIE_WAKE#: CN1.156(PCIE_WAKE#) ; off-sheet PCIE_WAKE#
PWGIN: CN1.26(PWGIN) ; off-sheet PWGIN
PWRBTN#: CN1.20(PWRBTN#) ; off-sheet PWRBTN#
Q7_MFG0: CN1.207(MFG_NC0) CN45.1
Q7_MFG1: CN1.209(MFG_NC1) CN45.3
Q7_MFG2: CN1.208(MFG_NC2) CN45.5
Q7_MFG3: CN1.210(MFG_NC3) CN45.7
Q7_RSVD56: CN1.56(RSVD56) CN46.3
Q7_RSVD92: CN1.92(RSVD92) CN46.4
Q7_RSVD124: CN1.124(RSVD124) CN46.5
Q7_RSVD129: CN1.129(RSVD129) CN46.6
Q7_RSVD130: CN1.130(RSVD130) CN46.7
Q7_RSVD199: CN1.199(RSVD199) CN46.8
Q7_RSVD200: CN1.200(RSVD200) CN46.9
Q7_RSVD201: CN1.201(RSVD201) CN46.10
Q7_RSVD202: CN1.202(RSVD202) CN46.11
Q7_RSVD203: CN1.203(RSVD203) CN46.12
Q7_RSVD204: CN1.204(RSVD204) CN46.13
RSTBTN#: CN1.28(RSTBTN#) ; off-sheet RSTBTN#
SATA0_RX+: CN1.35(SATA0_RX+) ; off-sheet SATA0_RX+
SATA0_RX-: CN1.37(SATA0_RX-) ; off-sheet SATA0_RX-
SATA0_TX+: CN1.29(SATA0_TX+) ; off-sheet SATA0_TX+
SATA0_TX-: CN1.31(SATA0_TX-) ; off-sheet SATA0_TX-
SATA1_RX+: CN1.36(SATA1_RX+) ; off-sheet SATA1_RX+
SATA1_RX-: CN1.38(SATA1_RX-) ; off-sheet SATA1_RX-
SATA1_TX+: CN1.30(SATA1_TX+) ; off-sheet SATA1_TX+
SATA1_TX-: CN1.32(SATA1_TX-) ; off-sheet SATA1_TX-
SATA_ACT#: CN1.33(SATA_ACT#) ; off-sheet SATA_ACT#
SDIO_CD#: CN1.43(SDIO_CD#) ; off-sheet SDIO_CD#
SDIO_CLK: CN1.42(SDIO_CLK) ; off-sheet SDIO_CLK
SDIO_CMD: CN1.45(SDIO_CMD) ; off-sheet SDIO_CMD
SDIO_DAT0: CN1.49(SDIO_DAT0) ; off-sheet SDIO_DAT0
SDIO_DAT1: CN1.48(SDIO_DAT1) ; off-sheet SDIO_DAT1
SDIO_DAT2: CN1.51(SDIO_DAT2) ; off-sheet SDIO_DAT2
SDIO_DAT3: CN1.50(SDIO_DAT3) ; off-sheet SDIO_DAT3
SDIO_DAT4: CN1.53(SDIO_DAT4) ; off-sheet SDIO_DAT4
SDIO_DAT5: CN1.52(SDIO_DAT5) ; off-sheet SDIO_DAT5
SDIO_DAT6: CN1.55(SDIO_DAT6) ; off-sheet SDIO_DAT6
SDIO_DAT7: CN1.54(SDIO_DAT7) ; off-sheet SDIO_DAT7
SDIO_LED: CN1.44(SDIO_LED) ; off-sheet SDIO_LED
SDIO_PWR#: CN1.47(SDIO_PWR#) ; off-sheet SDIO_PWR#
SDIO_WP: CN1.46(SDIO_WP) ; off-sheet SDIO_WP
SDVO_BCLK+: CN1.131(SDVO_BCLK+) ; off-sheet SDVO_BCLK+
SDVO_BCLK-: CN1.133(SDVO_BCLK-) ; off-sheet SDVO_BCLK-
SDVO_BLUE+: CN1.143(SDVO_BLUE+) ; off-sheet SDVO_BLUE+
SDVO_BLUE-: CN1.145(SDVO_BLUE-) ; off-sheet SDVO_BLUE-
SDVO_CTRL_CLK: CN1.152(SDVO_CTRL_CLK) ; off-sheet SDVO_CTRL_CLK
SDVO_CTRL_DAT: CN1.150(SDVO_CTRL_DAT) ; off-sheet SDVO_CTRL_DAT
SDVO_FLDSTALL+: CN1.138(SDVO_FLDSTALL+) ; off-sheet SDVO_FLDSTALL+
SDVO_FLDSTALL-: CN1.140(SDVO_FLDSTALL-) ; off-sheet SDVO_FLDSTALL-
SDVO_GREEN+: CN1.137(SDVO_GREEN+) ; off-sheet SDVO_GREEN+
SDVO_GREEN-: CN1.139(SDVO_GREEN-) ; off-sheet SDVO_GREEN-
SDVO_INT+: CN1.132(SDVO_INT+) ; off-sheet SDVO_INT+
SDVO_INT-: CN1.134(SDVO_INT-) ; off-sheet SDVO_INT-
SDVO_RED+: CN1.149(SDVO_RED+) ; off-sheet SDVO_RED+
SDVO_RED-: CN1.151(SDVO_RED-) ; off-sheet SDVO_RED-
SDVO_TVCLKIN+: CN1.144(SDVO_TVCLKIN+) ; off-sheet SDVO_TVCLKIN+
SDVO_TVCLKIN-: CN1.146(SDVO_TVCLKIN-) ; off-sheet SDVO_TVCLKIN-
SERIRQ: CN1.191(SERIRQ) ; off-sheet SERIRQ
SLP_BTN#: CN1.21(SLP_BTN#) ; off-sheet SLP_BTN#
SMB_ALERT#: CN1.64(SMB_ALERT#) ; off-sheet SMB_ALERT#
SMB_CLK: CN1.60(SMB_CLK) ; off-sheet SMB_CLK
SMB_DAT: CN1.62(SMB_DAT) ; off-sheet SMB_DAT
SPKR: CN1.194(SPKR) ; off-sheet SPKR
SUS_S3#: CN1.18(SUS_S3#) ; off-sheet SUS_S3#
SUS_S5#: CN1.16(SUS_S5#) ; off-sheet SUS_S5#
SUS_STAT#: CN1.19(SUS_STAT#) ; off-sheet SUS_STAT#
THRM#: CN1.69(THRM#) ; off-sheet THRM#
THRMTRIP#: CN1.71(THRMTRIP#) ; off-sheet THRMTRIP#
USB0_D+: CN1.96(USB_P0+) ; off-sheet USB0_D+
USB0_D-: CN1.94(USB_P0-) ; off-sheet USB0_D-
USB1_D+: CN1.95(USB_P1+) ; off-sheet USB1_D+
USB1_D-: CN1.93(USB_P1-) ; off-sheet USB1_D-
USB2_D+: CN1.90(USB_P2+) ; off-sheet USB2_D+
USB2_D-: CN1.88(USB_P2-) ; off-sheet USB2_D-
USB3_D+: CN1.89(USB_P3+) ; off-sheet USB3_D+
USB3_D-: CN1.87(USB_P3-) ; off-sheet USB3_D-
USB4_D+: CN1.84(USB_P4+) ; off-sheet USB4_D+
USB4_D-: CN1.82(USB_P4-) ; off-sheet USB4_D-
USB5_D+: CN1.83(USB_P5+) ; off-sheet USB5_D+
USB5_D-: CN1.81(USB_P5-) ; off-sheet USB5_D-
USB6_D+: CN1.78(USB_P6+) ; off-sheet USB6_D+
USB6_D-: CN1.76(USB_P6-) ; off-sheet USB6_D-
USB7_D+: CN1.77(USB_P7+) ; off-sheet USB7_D+
USB7_D-: CN1.75(USB_P7-) ; off-sheet USB7_D-
USB_0_1_OC#: CN1.86(USB_0_1_OC#) ; off-sheet USB_0_1_OC#
USB_2_3_OC#: CN1.85(USB_2_3_OC#) ; off-sheet USB_2_3_OC#
USB_4_5_OC#: CN1.80(USB_4_5_OC#) ; off-sheet USB_4_5_OC#
USB_6_7_OC#: CN1.79(USB_6_7_OC#) ; off-sheet USB_6_7_OC#
USB_CL_PRES: CN1.91(USB_CL_PRES) ; off-sheet USB_CL_PRES
WAKE#: CN1.17(WAKE#) ; off-sheet WAKE#
WDOUT: CN1.72(WDOUT) ; off-sheet WDOUT
WDTRIG#: CN1.70(WDTRIG#) ; off-sheet WDTRIG#

Not connected (* = marked no-connect by the designer): CN1 H1 H2 H3 H4; CN46 2

### Notes on the sheet
- (in symbol TitleBlock_CONGA) Title; Size; Document Number; Created; Rev; Date:; Sheet; of

### Library data of the parts
C1 C3 C15 = 11_C_0: CAP 22uF 16V X5R SMD 1206 MLCC WO/PB; Part Number: 1100001310; Manufacture Part Number: KC30R1C226M-T; Part_Number: 41000341; Tolerance: 20%; ProcessType: SMT; BOM_Level: 1; Package: 1206; Revision: A
C2 C4 C14 = 11_C_0: as C137 on sheet PG13_ USB Ports; Revision: A; Package: 0603
CN1 = Qseven: Part Number: 1654005496; Part_Number: 41500262; BOM_Level: 1; Revision: A
CN45 = 1653_JH4X2V_0: PIN HEADER 4*2P 180D(M) 2.54mm DIP WO/Pb; Part_Number: 41500115; Manufacture Part Number: 201-2*4GS試21N22564-08S10B-01G-6/3; Part Number: 1653004200; BOM_Level: 1; Revision: A; ProcessType: DIP; Package: PH4x2P-2.54
CN46 = 1653_JH7X2V_0: PIN HEADER 7*2P 180D(M) 2.54mm DIP WO/Pb; Manufacture Part Number: $1653007200試1130-010-14S試21N22564-14S10B-01G-6/3; Part Number: 1653007200; Part_Number: 41500322; BOM_Level: 1; ProcessType: DIP; Package: PH7x2P-2.54; Revision: A
*#7 = TitleBlock_CONGA: Page Create Date: March  8, 1995

## Sheet PG02_ Block Diagram.SchDoc
size 420 x 297 mm
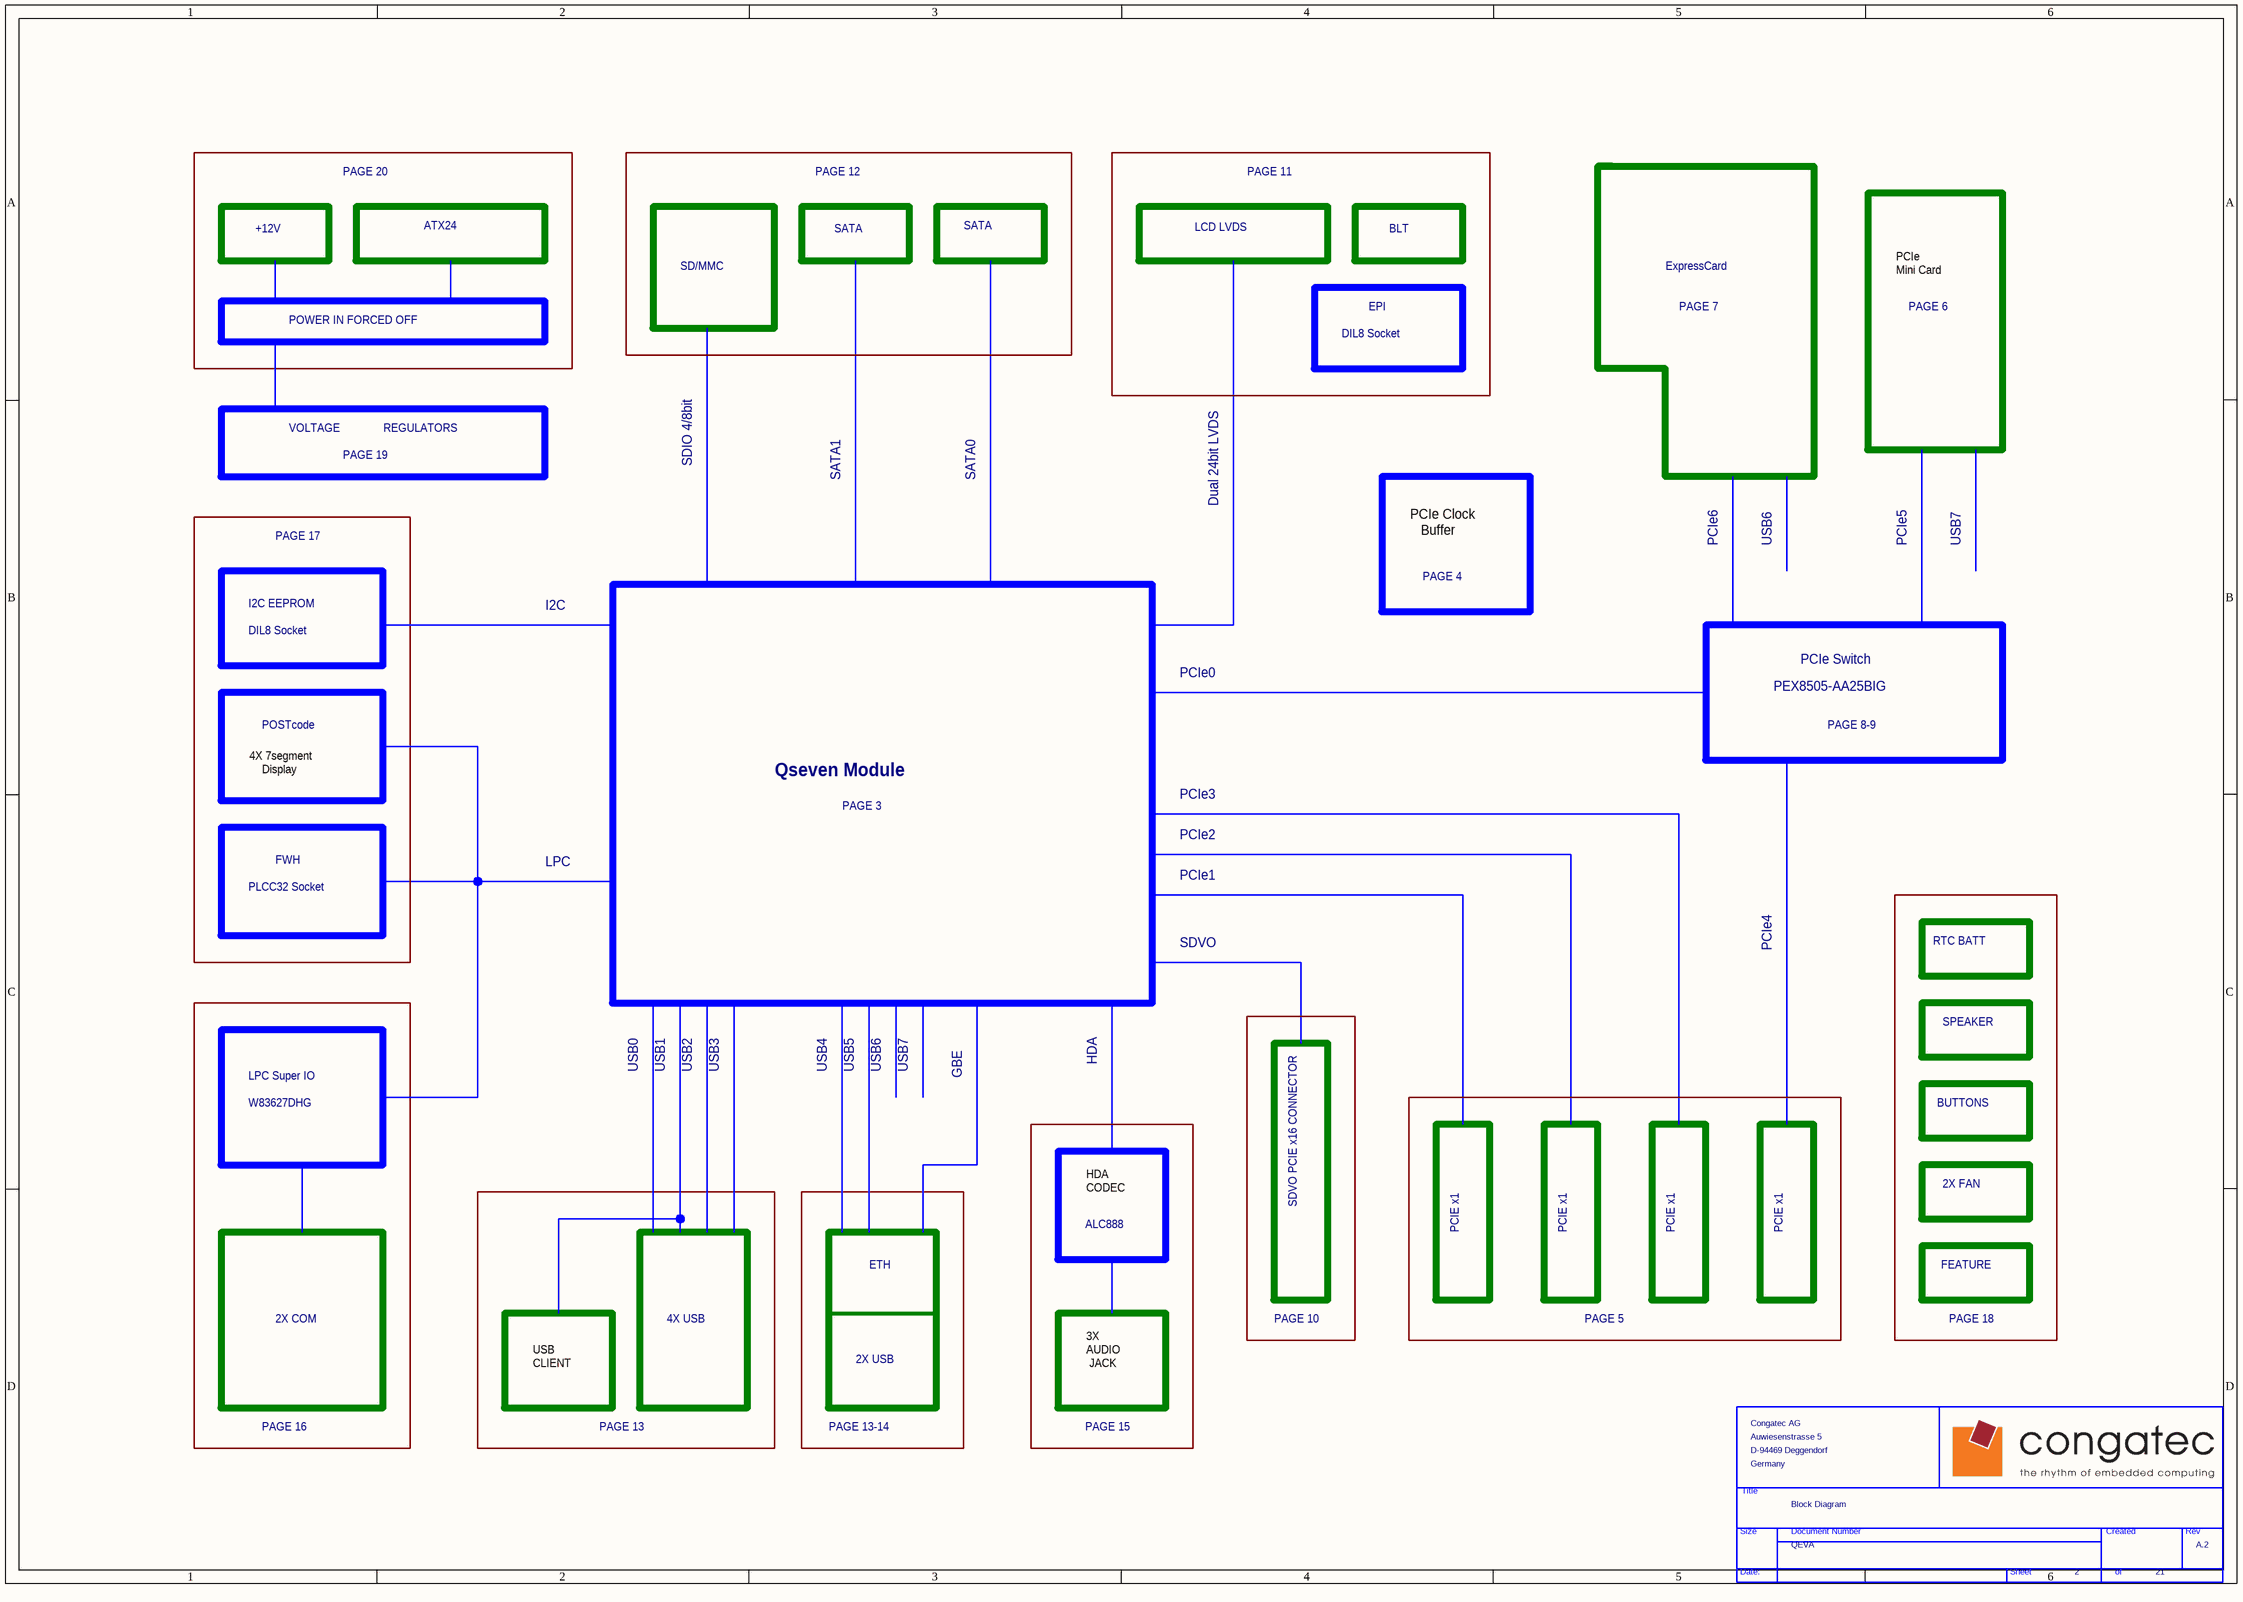
[diagram p7: PG02_ Block Diagram.SchDoc]

### Parts
(Parts that share a designator on the sheet are numbered #1, #2 ... from top to bottom, then left to right.)
*#8  Page Count: 21  Page Number: 2  Title: Block Diagram  RevCode: A.2  Doc: QEVA  OrgName: Congatec AG  OrgAddr1: Auwiesenstrasse 5  OrgAddr2: D-94469 Deggendorf  OrgAddr3: Germany  (hidden comment: TitleBlock_CONGA)  (graphical)

### Notes on the sheet
- PAGE 20
- PAGE 12
- PAGE 11
- +12V
- ATX24
- SATA
- LCD LVDS
- BLT
- POWER IN FORCED OFF
- SD/MMC
- EPI
- ExpressCard
- PAGE 7
- PCIe
  Mini Card
- PAGE 6
- DIL8 Socket
- VOLTAGE
- PAGE 19
- REGULATORS
- SDIO 4/8bit
- SATA1
- SATA0
- Dual 24bit LVDS
- PAGE 17
- PCIe Clock
  Buffer
- PAGE 4
- PCIe6
- USB6
- PCIe5
- USB7
- I2C EEPROM
- I2C
- PCIe Switch
- POSTcode
- PCIe0
- PEX8505-AA25BIG
- PAGE 8-9
- 4X 7segment
  Display
- Qseven Module
- PCIe3
- FWH
- LPC
- PAGE 3
- PCIe2
- PLCC32 Socket
- PCIe1
- SDVO
- PCIe4
- RTC BATT
- USB0
- USB1
- USB2
- USB3
- USB4
- USB5
- HDA
- SPEAKER
- LPC Super IO
- W83627DHG
- GBE
- BUTTONS
- HDA
  CODEC
- SDVO PCIE x16 CONNECTOR
- 2X FAN
- ETH
- ALC888
- PCIE x1
- FEATURE
- 2X COM
- 4X USB
- PAGE 10
- PAGE 5
- PAGE 18
- USB
  CLIENT
- 2X USB
- 3X
  AUDIO
  JACK
- PAGE 16
- PAGE 13
- PAGE 13-14
- PAGE 15
- (in symbol TitleBlock_CONGA) Title; Size; Document Number; Created; Rev; Date:; Sheet; of

### Library data of the parts
*#8 = TitleBlock_CONGA: Page Create Date: March  8, 1995

## Sheet PG01_ Cover Sheet.SchDoc
size 420 x 297 mm
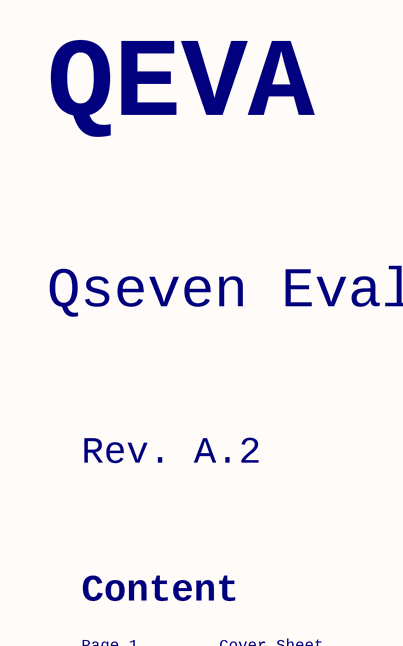
[diagram p8: PG01_ Cover Sheet.SchDoc, top left]
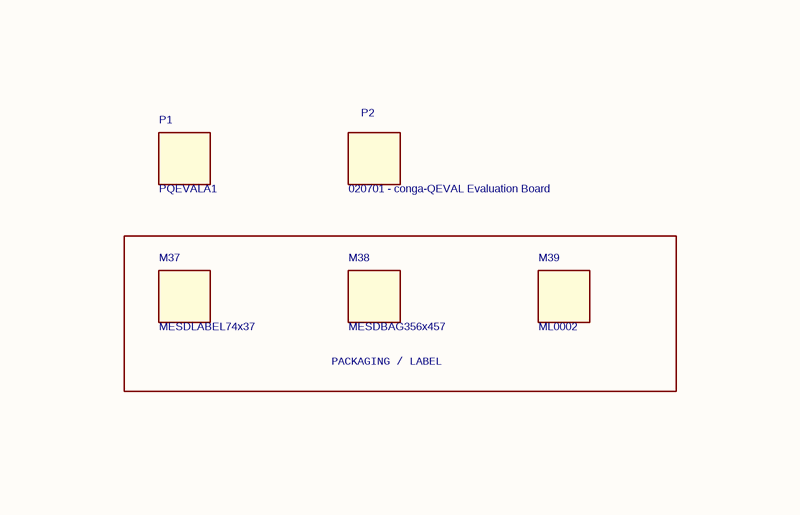
[diagram p9: PG01_ Cover Sheet.SchDoc, top right]
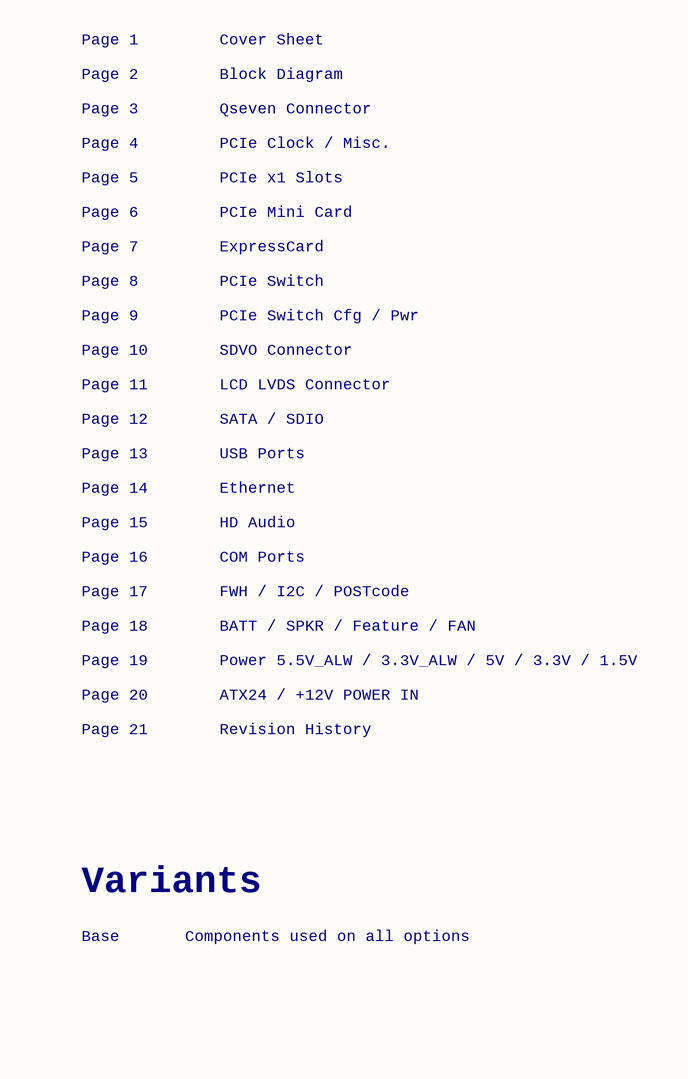
[diagram p10: PG01_ Cover Sheet.SchDoc, bottom left]
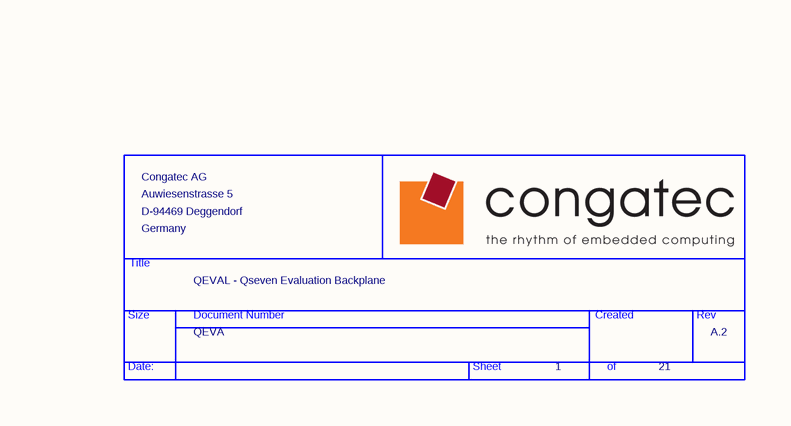
[diagram p11: PG01_ Cover Sheet.SchDoc, bottom right]

### Parts
(Parts that share a designator on the sheet are numbered #1, #2 ... from top to bottom, then left to right.)
*#9  Page Count: 21  Page Number: 1  Title: QEVAL - Qseven Evaluation Backplane  RevCode: A.2  Doc: QEVA  OrgName: Congatec AG  OrgAddr1: Auwiesenstrasse 5  OrgAddr2: D-94469 Deggendorf  OrgAddr3: Germany  (hidden comment: TitleBlock_CONGA)  (graphical)
M37  MESDLABEL74x37
M38  MESDBAG356x457
M39  ML0002
P1  PQEVALA1
P2  020701 - conga-QEVAL Evaluation Board

### Blocks framed on the sheet
PACKAGING / LABEL: M37-M39

### Notes on the sheet
- QEVA
- Qseven Evaluation Backplane
- Rev. A.2
- Content
- Page 1
- Cover Sheet
- Page 2
- Page 3
- Page 4
- Block Diagram
- Qseven Connector
- PCIe Clock / Misc.
- Page 5
- Page 6
- PCIe Mini Card
- PCIe x1 Slots
- Page 7
- Page 8
- Page 9
- ExpressCard
- PCIe Switch Cfg / Pwr
- PCIe Switch
- Page 10
- Page 11
- SDVO Connector
- LCD LVDS Connector
- Page 12
- Page 13
- Page 14
- SATA / SDIO
- Ethernet
- USB Ports
- Page 15
- Page 16
- COM Ports
- HD Audio
- Page 17
- Page 18
- Page 19
- FWH / I2C / POSTcode
- BATT / SPKR / Feature / FAN
- Power 5.5V_ALW / 3.3V_ALW / 5V / 3.3V / 1.5V
- Page 20
- Page 21
- Revision History
- ATX24 / +12V POWER IN
- Variants
- Base
- Components used on all options
- (in symbol TitleBlock_CONGA) Title; Size; Document Number; Created; Rev; Date:; Sheet; of

### Library data of the parts
M37 = Box PCB: Part_Number: 72000001; ManufacturerName1: Labelident; ManufacturerPart1: W120-74; BOM_Level: 1; ManufacturerDatasheet1: http://conds01/svn/Datasheet_DB/CIS/Miscellaneous/Labelident/LABELIDENT_KatalogSeite30-31.pdf; Revision: A
M38 = Box PCB: Part_Number: 71000001; ManufacturerName1: Ubitec; ManufacturerPart1: UA-3310.HS.1418/.1; BOM_Level: 1; ManufacturerDatasheet1: http://conds01/svn/Datasheet_DB/CIS/Miscellaneous/Ubitec/Highshield%20Verpackungsbeutel.pdf; Revision: A
M39 = Box PCB: Part_Number: 72000011; ManufacturerName1: Labelident; ManufacturerPart1: ERT-A032x009; BOM_Level: 1; ManufacturerDatasheet1: http://conds01/svn/Datasheet_DB/CIS/Miscellaneous/Labelident/LABELIDENT_KatalogSeite4.pdf; Revision: A
P1 = Box PCB: Part_Number: 45000136; BOM_Level: 1; Revision: A.1
P2 = Box PCB: Part_Number: 007001A; BOM_Level: 0; Revision: A.2
*#9 = TitleBlock_CONGA: Page Create Date: March  8, 1995

## Nets that join several sheets
+V3.3: PG14_ Ethernet (CN47.3), PG13_ USB Ports (R116.1 R117.1), PG12_ SATA _ SDIO (R113.1 R115.1 U12.5), PG03_ Qseven Connector (CN45.4 CN46.1)
+V5: PG18_ BATT_ SPK _ Featu (D29.3 U23.1), PG13_ USB Ports (11 pins), PG03_ Qseven Connector (25 pins)
+V5_ALW: PG13_ USB Ports (5 pins), PG03_ Qseven Connector (C14.1 C15.1 CN1.205 CN1.206)
CHASSIS: PG14_ Ethernet (8 pins), PG13_ USB Ports (13 pins)
GND: PG18_ BATT_ SPK _ Featu (9 pins), PG14_ Ethernet (11 pins), PG13_ USB Ports (37 pins), PG12_ SATA _ SDIO (12 pins), PG03_ Qseven Connector (39 pins)
GBE_ACT#: PG14_ Ethernet (R124.2 U16.5), PG03_ Qseven Connector (CN1.14)
GBE_CTREF: PG14_ Ethernet (CN22.1), PG03_ Qseven Connector (CN1.15)
GBE_LINK100#: PG14_ Ethernet (R125.2 U16.9), PG03_ Qseven Connector (CN1.7)
GBE_LINK1000#: PG14_ Ethernet (R126.2 U16.12), PG03_ Qseven Connector (CN1.8)
GBE_LINK#: PG14_ Ethernet (R122.2 U16.2), PG03_ Qseven Connector (CN1.13)
GBE_MDI0+: PG14_ Ethernet (CN22.2), PG03_ Qseven Connector (CN1.12)
GBE_MDI0-: PG14_ Ethernet (CN22.3), PG03_ Qseven Connector (CN1.10)
GBE_MDI1+: PG14_ Ethernet (CN22.4), PG03_ Qseven Connector (CN1.11)
GBE_MDI1-: PG14_ Ethernet (CN22.5), PG03_ Qseven Connector (CN1.9)
GBE_MDI2+: PG14_ Ethernet (CN22.6), PG03_ Qseven Connector (CN1.6)
GBE_MDI2-: PG14_ Ethernet (CN22.7), PG03_ Qseven Connector (CN1.4)
GBE_MDI3+: PG14_ Ethernet (CN22.8), PG03_ Qseven Connector (CN1.5)
GBE_MDI3-: PG14_ Ethernet (CN22.9), PG03_ Qseven Connector (CN1.3)
LID_BTN#: PG18_ BATT_ SPK _ Featu (SW4.3 SW4.4), PG03_ Qseven Connector (CN1.22)
PWRBTN#: PG18_ BATT_ SPK _ Featu (SW1.3 SW1.4), PG03_ Qseven Connector (CN1.20)
RSTBTN#: PG18_ BATT_ SPK _ Featu (SW3.3 SW3.4), PG03_ Qseven Connector (CN1.28)
SATA0_RX+: PG12_ SATA _ SDIO (CN17.6), PG03_ Qseven Connector (CN1.35)
SATA0_RX-: PG12_ SATA _ SDIO (CN17.5), PG03_ Qseven Connector (CN1.37)
SATA0_TX+: PG12_ SATA _ SDIO (CN17.2), PG03_ Qseven Connector (CN1.29)
SATA0_TX-: PG12_ SATA _ SDIO (CN17.3), PG03_ Qseven Connector (CN1.31)
SATA1_RX+: PG12_ SATA _ SDIO (CN19.6), PG03_ Qseven Connector (CN1.36)
SATA1_RX-: PG12_ SATA _ SDIO (CN19.5), PG03_ Qseven Connector (CN1.38)
SATA1_TX+: PG12_ SATA _ SDIO (CN19.2), PG03_ Qseven Connector (CN1.30)
SATA1_TX-: PG12_ SATA _ SDIO (CN19.3), PG03_ Qseven Connector (CN1.32)
SATA_ACT#: PG12_ SATA _ SDIO (R115.2 U12.2), PG03_ Qseven Connector (CN1.33)
SLP_BTN#: PG18_ BATT_ SPK _ Featu (SW2.3 SW2.4), PG03_ Qseven Connector (CN1.21)
SPKR: PG18_ BATT_ SPK _ Featu (Q19.1), PG03_ Qseven Connector (CN1.194)
USB0_D+: PG13_ USB Ports (B6.1), PG03_ Qseven Connector (CN1.96)
USB0_D-: PG13_ USB Ports (B6.2), PG03_ Qseven Connector (CN1.94)
USB1_D+: PG13_ USB Ports (B7.1), PG03_ Qseven Connector (CN1.95)
USB1_D-: PG13_ USB Ports (B7.2), PG03_ Qseven Connector (CN1.93)
USB2_D+: PG13_ USB Ports (B10.1), PG03_ Qseven Connector (CN1.90)
USB2_D-: PG13_ USB Ports (B10.2), PG03_ Qseven Connector (CN1.88)
USB3_D+: PG13_ USB Ports (B12.1), PG03_ Qseven Connector (CN1.89)
USB3_D-: PG13_ USB Ports (B12.2), PG03_ Qseven Connector (CN1.87)
USB4_D+: PG13_ USB Ports (B15.1), PG03_ Qseven Connector (CN1.84)
USB4_D-: PG13_ USB Ports (B15.2), PG03_ Qseven Connector (CN1.82)
USB5_D+: PG13_ USB Ports (B18.1), PG03_ Qseven Connector (CN1.83)
USB5_D-: PG13_ USB Ports (B18.2), PG03_ Qseven Connector (CN1.81)
USB_0_1_OC#: PG13_ USB Ports (U13.2 U13.3), PG03_ Qseven Connector (CN1.86)
USB_2_3_OC#: PG13_ USB Ports (U14.2 U14.3), PG03_ Qseven Connector (CN1.85)
USB_4_5_OC#: PG13_ USB Ports (U15.2 U15.3), PG03_ Qseven Connector (CN1.80)
USB_CL_PRES: PG13_ USB Ports (Q11.3 R116.2), PG03_ Qseven Connector (CN1.91)